# EAGLE design OSO-TIBO-A1-01 (EAGLE 9.4.2)

## Sheet 1 of 2
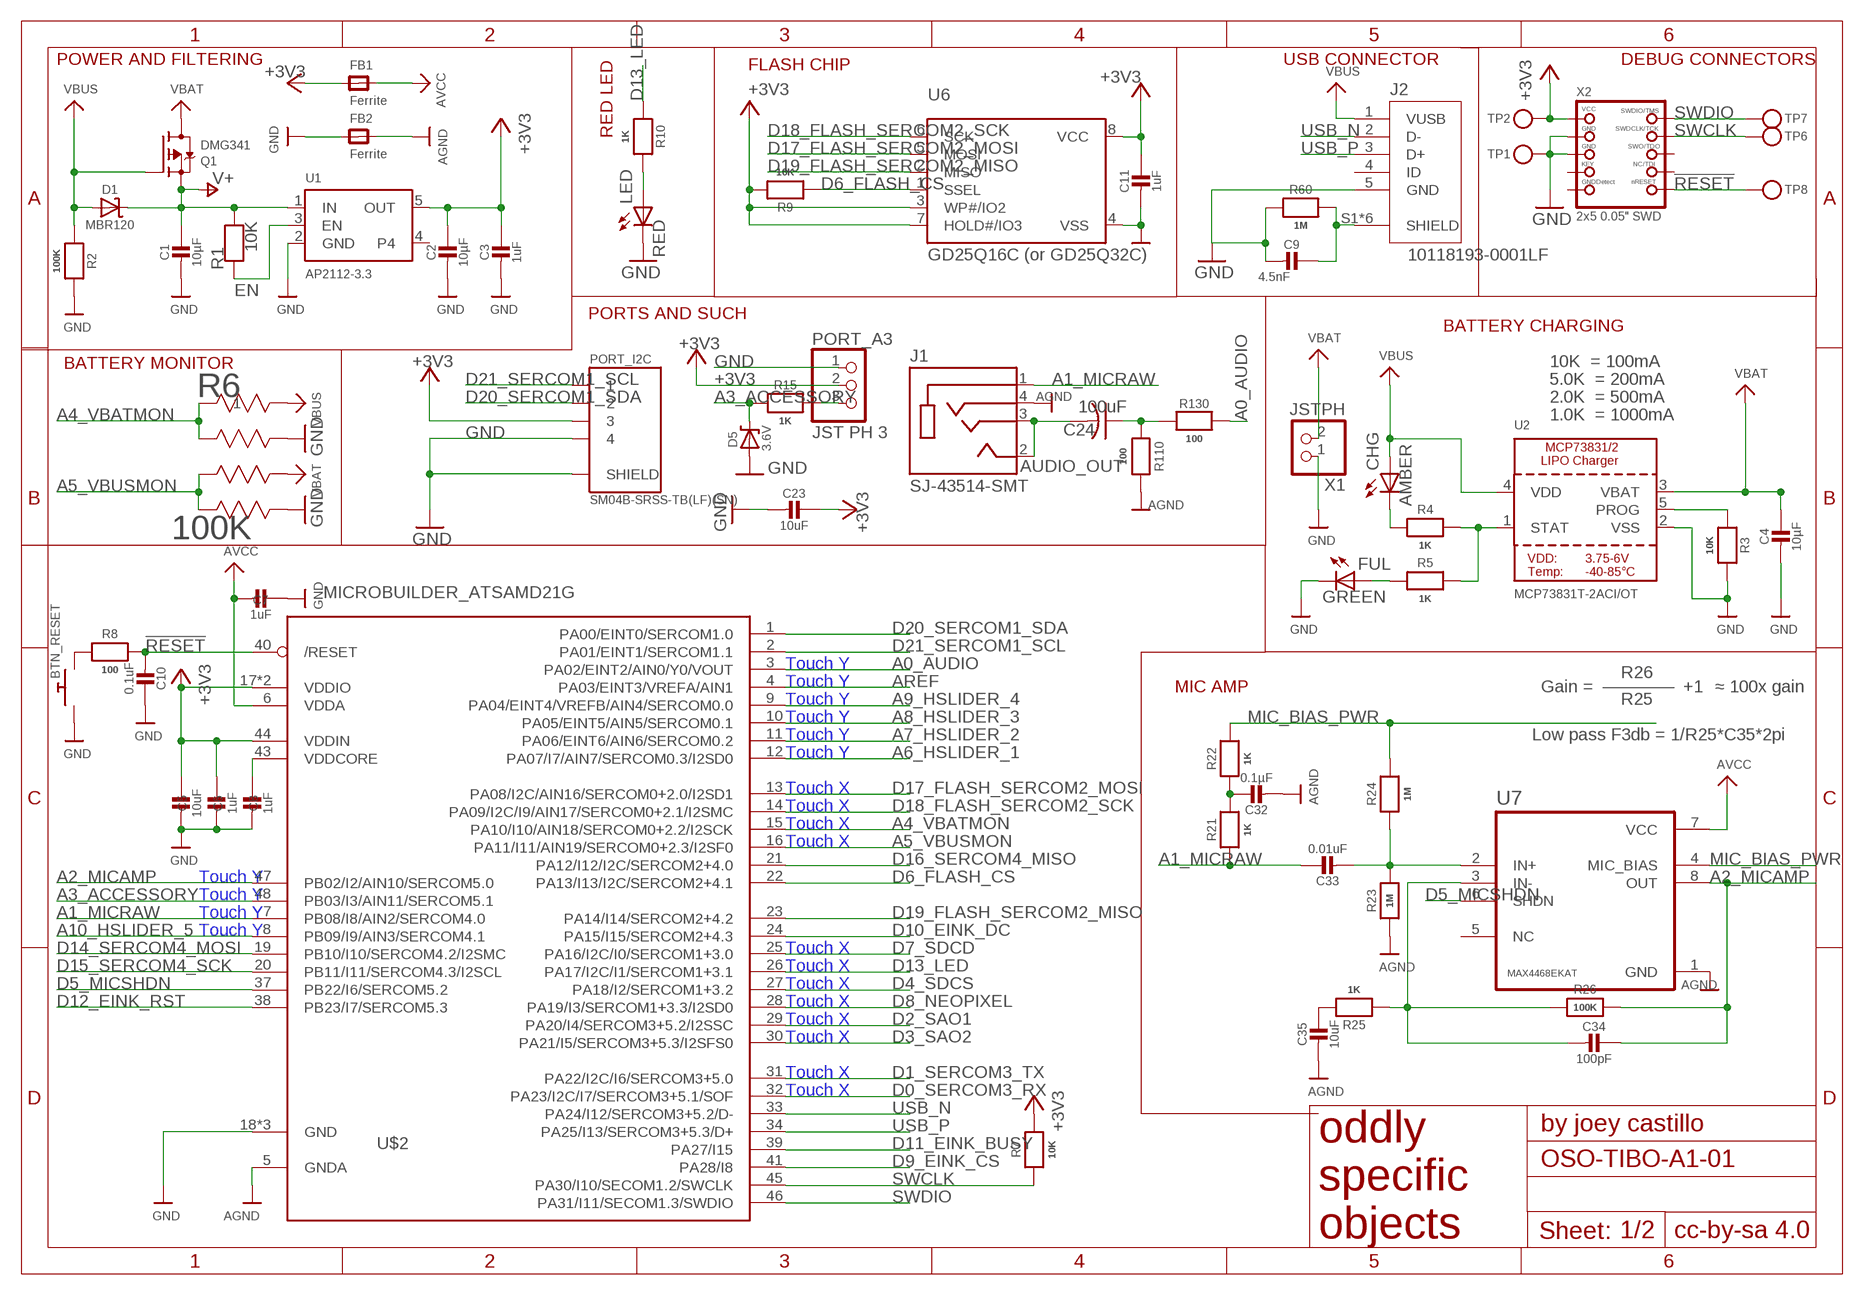
[diagram p0: schematic, sheet 1]

### Parts
BTN_RESET  SPST_TACTILE_SWITCHRA-THRU  [MJTP1117]
C1  10µF  CAP_CERAMIC0805-NOOUTLINE  [0805-NO]
C2  10µF  CAP_CERAMIC0805-NOOUTLINE  [0805-NO]
C3  1uF  CAP_CERAMIC0805-NOOUTLINE  [0805-NO]
C4  10µF  CAP_CERAMIC0805-NOOUTLINE  [0805-NO]
C5  10uF  CAP_CERAMIC0805_10MGAP  [0805_10MGAP]
C6  1uF  CAP_CERAMIC0805-NOOUTLINE  [0805-NO]
C7  1uF  CAP_CERAMIC0805-NOOUTLINE  [0805-NO]
C8  1uF  CAP_CERAMIC0805-NOOUTLINE  [0805-NO]
C9  4.5nF  CAP_CERAMIC0805-NOOUTLINE  [0805-NO]
C10  0.1uF  CAP_CERAMIC0805_10MGAP  [0805_10MGAP]
C11  1uF  CAP_CERAMIC0805_10MGAP  [0805_10MGAP]
C23  10uF  CAP_CERAMIC0805-NOOUTLINE  [0805-NO]
C24  100uF  C-USC1210  [C1210]
C32  0.1µF  CAP_CERAMIC0805-NOOUTLINE  [0805-NO]
C33  0.01uF  CAP_CERAMIC0805-NOOUTLINE  [0805-NO]
C34  100pF  CAP_CERAMIC0805-NOOUTLINE  [0805-NO]
C35  10uF  CAP_CERAMIC0805-NOOUTLINE  [0805-NO]
CHG  AMBER  LEDCHIP-LED0805  [CHIP-LED0805]
D1  MBR120  DIODE-SCHOTTKYSOD-123  [SOD-123]
D5  3.6V  DIODE-ZENERSOD123  [SOD-123]
FB1  Ferrite  FERRITE0805  [0805]
FB2  Ferrite  FERRITE0805  [0805]
FUL  GREEN  LEDCHIP-LED0805  [CHIP-LED0805]
J1  SJ-43514-SMT  [CUI_SJ-43514-SMT]
J2  10118193-0001LF  [FCI_10118193-0001LF]
LED  RED  LEDCHIP-LED0805  [CHIP-LED0805]
PORT_A3  JST PH 3  CON_JST_PH_3PIN  [JSTPH3]
PORT_I2C  SM04B-SRSS-TB(LF)(SN)  [JST_SM04B-SRSS-TB(LF)(SN)]
Q1  DMG341  MOSFET-P  [SOT23-R]
R1  10K  RESISTOR0805_NOOUTLINE  [0805-NO]
R2  100K  RESISTOR0805_NOOUTLINE  [0805-NO]
R3  10K  RESISTOR0805_NOOUTLINE  [0805-NO]
R4  1K  RESISTOR0805_NOOUTLINE  [0805-NO]
R5  1K  RESISTOR0805_NOOUTLINE  [0805-NO]
R6  100K  EXB-V8V103JV  [EXBV8V]
R7  10K  RESISTOR0805_NOOUTLINE  [0805-NO]
R8  100  RESISTOR0805_10MGAP  [0805_10MGAP]
R9  10K  RESISTOR0805_NOOUTLINE  [0805-NO]
R10  1K  RESISTOR0805_NOOUTLINE  [0805-NO]
R15  1K  RESISTOR_0805MP  [_0805MP]
R21  1K  RESISTOR0805_NOOUTLINE  [0805-NO]
R22  1K  RESISTOR0805_NOOUTLINE  [0805-NO]
R23  1M  RESISTOR0805_NOOUTLINE  [0805-NO]
R24  1M  RESISTOR0805_NOOUTLINE  [0805-NO]
R25  1K  RESISTOR0805_NOOUTLINE  [0805-NO]
R26  100K  RESISTOR0805_NOOUTLINE  [0805-NO]
R60  1M  RESISTOR0805_NOOUTLINE  [0805-NO]
R110  100  RESISTOR0805_NOOUTLINE  [0805-NO]
R130  100  RESISTOR0805_NOOUTLINE  [0805-NO]
TP1  TESTPOINTROUND2MMNO  [TESTPOINT_ROUND_2MM_NO]
TP2  TESTPOINTROUND2MMNO  [TESTPOINT_ROUND_2MM_NO]
TP6  TESTPOINTROUND2MMNO  [TESTPOINT_ROUND_2MM_NO]
TP7  TESTPOINTROUND2MMNO  [TESTPOINT_ROUND_2MM_NO]
TP8  TESTPOINTROUND2MMNO  [TESTPOINT_ROUND_2MM_NO]
U1  AP2112-3.3  VREG_SOT23-5  [SOT23-5]
U2  MCP73831T-2ACI/OT  MCP73831/2  [SOT23-5]
U6  GD25Q16C (or GD25Q32C)  MICROBUILDER_SPIFLASH_SOIC8  [MICROBUILDER_SOIC8_150MIL]
U7  MAX4468EKAT  [SOT65P280X145-8N]
U$2  MICROBUILDER_ATSAMD21G  [QFP50P900X900X120-48N]
X1  JSTPH  CON_JST_PH_2PIN  [JSTPH2]
X2  2x5 0.05" SWD  JTAG-CORTEXBOXPOSTS  [2X05_1.27MM_BOX_POSTS]

### Nets
!RESET: C10.2 R8.2 TP8.P$1 U$2.40(/RESET) X2.10(NRESET)
+3V3 [power]: C2.1 C3.1 C5.1 C6.1 C11.1 C23.1 FB1.1 PORT_A3.2 PORT_I2C.3 R7.2 R9.2 TP2.P$1 U1.5(OUT) U6.3(WP#/IO2) U6.7(HOLD#/IO3) U6.8(VCC) U$2.17(VDDIO) U$2.36(VDDIO) U$2.44(VDDIN) X2.1(VCC) ; also sheet 2
_ACCESSORY: PORT_A3.3 R15.1
A0_AUDIO: R130.1 U$2.3(PA02/EINT2/AIN0/Y0/VOUT)
A1_MICRAW: C33.1 J1.1(SLEEVE) R21.1 U$2.7(PB08/I8/AIN2/SERCOM4.0)
A2_MICAMP: C34.1 R26.2 U7.8(OUT) U$2.47(PB02/I2/AIN10/SERCOM5.0)
A3_ACCESSORY: D5.C R15.2 U$2.48(PB03/I3/AIN11/SERCOM5.1)
A4_VBATMON: R6.1 R6.2 U$2.15(PA10/I10/AIN18/SERCOM0+2.2/I2SCK)
A5_VBUSMON: R6.3 R6.4 U$2.16(PA11/I11/AIN19/SERCOM0+2.3/I2SF0)
A6_HSLIDER_1: U$2.12(PA07/I7/AIN7/SERCOM0.3/I2SD0) ; also sheet 2
A7_HSLIDER_2: U$2.11(PA06/EINT6/AIN6/SERCOM0.2) ; also sheet 2
A8_HSLIDER_3: U$2.10(PA05/EINT5/AIN5/SERCOM0.1) ; also sheet 2
A9_HSLIDER_4: U$2.9(PA04/EINT4/VREFB/AIN4/SERCOM0.0) ; also sheet 2
A10_HSLIDER_5: U$2.8(PB09/I9/AIN3/SERCOM4.1) ; also sheet 2
AGND [gnd]: C32.2 C35.2 FB2.2 J1.4(RING2) R23.1 R110.1 U7.1(GND) U$2.5(GNDA)
AREF: U$2.4(PA03/EINT3/VREFA/AIN1)
AUDIO_OUT: C24.2 J1.2(TIP) J1.3(RING1)
AVCC: C7.2 FB1.2 U7.7(VCC) U$2.6(VDDA)
D0_SERCOM3_RX: U$2.32(PA23/I2C/I7/SERCOM3+5.1/SOF) ; also sheet 2
D1_SERCOM3_TX: U$2.31(PA22/I2C/I6/SERCOM3+5.0) ; also sheet 2
D2_SAO1: U$2.29(PA20/I4/SERCOM3+5.2/I2SSC)
D3_SAO2: U$2.30(PA21/I5/SERCOM3+5.3/I2SFS0)
D4_SDCS: U$2.27(PA18/I2/SERCOM1+3.2) ; also sheet 2
D5_MICSHDN: U7.6(SHDN) U$2.37(PB22/I6/SERCOM5.2)
D6_FLASH_CS: R9.1 U6.1(SSEL) U$2.22(PA13/I13/I2C/SERCOM2+4.1)
D7_SDCD: U$2.25(PA16/I2C/I0/SERCOM1+3.0) ; also sheet 2
D8_NEOPIXEL: U$2.28(PA19/I3/SERCOM1+3.3/I2SD0) ; also sheet 2
D9_EINK_CS: U$2.41(PA28/I8) ; also sheet 2
D10_EINK_DC: U$2.24(PA15/I15/SERCOM2+4.3) ; also sheet 2
D11_EINK_BUSY: U$2.39(PA27/I15) ; also sheet 2
D12_EINK_RST: U$2.38(PB23/I7/SERCOM5.3) ; also sheet 2
D13_LED: R10.1 U$2.26(PA17/I2C/I1/SERCOM1+3.1)
D14_SERCOM4_MOSI: U$2.19(PB10/I10/SERCOM4.2/I2SMC) ; also sheet 2
D15_SERCOM4_SCK: U$2.20(PB11/I11/SERCOM4.3/I2SCL) ; also sheet 2
D16_SERCOM4_MISO: U$2.21(PA12/I12/I2C/SERCOM2+4.0) ; also sheet 2
D17_FLASH_SERCOM2_MOSI: U6.5(MOSI) U$2.13(PA08/I2C/AIN16/SERCOM0+2.0/I2SD1)
D18_FLASH_SERCOM2_SCK: U6.6(SCK) U$2.14(PA09/I2C/I9/AIN17/SERCOM0+2.1/I2SMC)
D19_FLASH_SERCOM2_MISO: U6.2(MISO) U$2.23(PA14/I14/SERCOM2+4.2)
D20_SERCOM1_SDA: PORT_I2C.2 U$2.1(PA00/EINT0/SERCOM1.0)
D21_SERCOM1_SCL: PORT_I2C.1 U$2.2(PA01/EINT1/SERCOM1.1)
EN: R1.1 U1.3(EN) ; also sheet 2
GND [gnd]: BTN_RESET.P$1 C1.2 C2.2 C3.2 C4.2 C5.2 C6.2 C7.1 C8.2 C9.2 C10.1 C11.2 C23.2 D5.A FB2.1 FUL.C J2.5(GND) LED.C PORT_A3.1 PORT_I2C.4 PORT_I2C.S1(SHIELD) PORT_I2C.S2(SHIELD) R2.2 R3.2 R6.5 R6.7 R60.2 TP1.P$1 U1.2(GND) U2.2(VSS) U6.4(VSS) U$2.18(GND) U$2.35(GND) U$2.42(GND) X1.1 X2.3(GND) X2.5(GND) ; also sheet 2
MIC_BIAS_PWR: R22.2 R24.2 U7.4(MIC_BIAS)
N$1: BTN_RESET.P$2 R8.1
N$4: CHG.C R4.1
N$6: C24.1 R110.2 R130.2
N$7: LED.A R10.2
N$9: FUL.A R5.1
N$65: C32.1 R21.2 R22.1
N$67: C33.2 R23.2 R24.1 U7.2(IN+)
N$68: C34.2 R25.1 R26.1 U7.3(IN-)
N$69: C35.1 R25.2
PROG: R3.1 U2.5(PROG)
SHIELD [gnd]: C9.1 J2.S1(SHIELD) J2.S2(SHIELD) J2.S3(SHIELD) J2.S4(SHIELD) J2.S5(SHIELD) J2.S6(SHIELD) R60.1
STAT: R4.2 R5.2 U2.1(STAT)
SWCLK: R7.1 TP6.P$1 U$2.45(PA30/I10/SECOM1.2/SWCLK) X2.4(SWDCLK)
SWDIO: TP7.P$1 U$2.46(PA31/I11/SECOM1.3/SWDIO) X2.2(SWDIO)
USB_N: J2.2(D-) U$2.33(PA24/I12/SERCOM3+5.2/D-)
USB_P: J2.3(D+) U$2.34(PA25/I13/SERCOM3+5.3/D+)
V+ [power]: C1.1 D1.C Q1.2(S) R1.2 U1.1(IN)
VBAT [power]: C4.1 Q1.3(D) R6.6 U2.3(VBAT) X1.2
VBUS [power]: CHG.A D1.A J2.1(VUSB) Q1.1(G) R2.1 R6.8 U2.4(VDD)
VDDCORE: C8.1 U$2.43(VDDCORE)
Unconnected: J2.4(ID) U1.4 U7.5(NC) X2.6(SWO) X2.7(KEY) X2.8(TDI) X2.9(GNDDETECT)

### Notes on the sheet
- RED LED
- POWER AND FILTERING | USB CONNECTOR | DEBUG CONNECTORS
- FLASH CHIP
- PORTS AND SUCH
- BATTERY CHARGING
- BATTERY MONITOR | 10K  = 100mA
- 5.0K  = 200mA
- 2.0K  = 500mA
- 1.0K  = 1000mA
- Touch Y
- R26
- Touch Y
- MIC AMP | Gain = | +1 | ≈ 100x gain
- Touch Y | R25
- Touch Y
- Touch Y | Low pass F3db = 1/R25*C35*2pi
- Touch Y
- Touch X
- Touch X
- Touch X
- Touch X
- Touch Y
- Touch Y
- Touch Y
- Touch Y
- Touch X
- Touch X
- Touch X
- Touch X
- Touch X
- Touch X
- Touch X
- Touch X

## Sheet 2 of 2
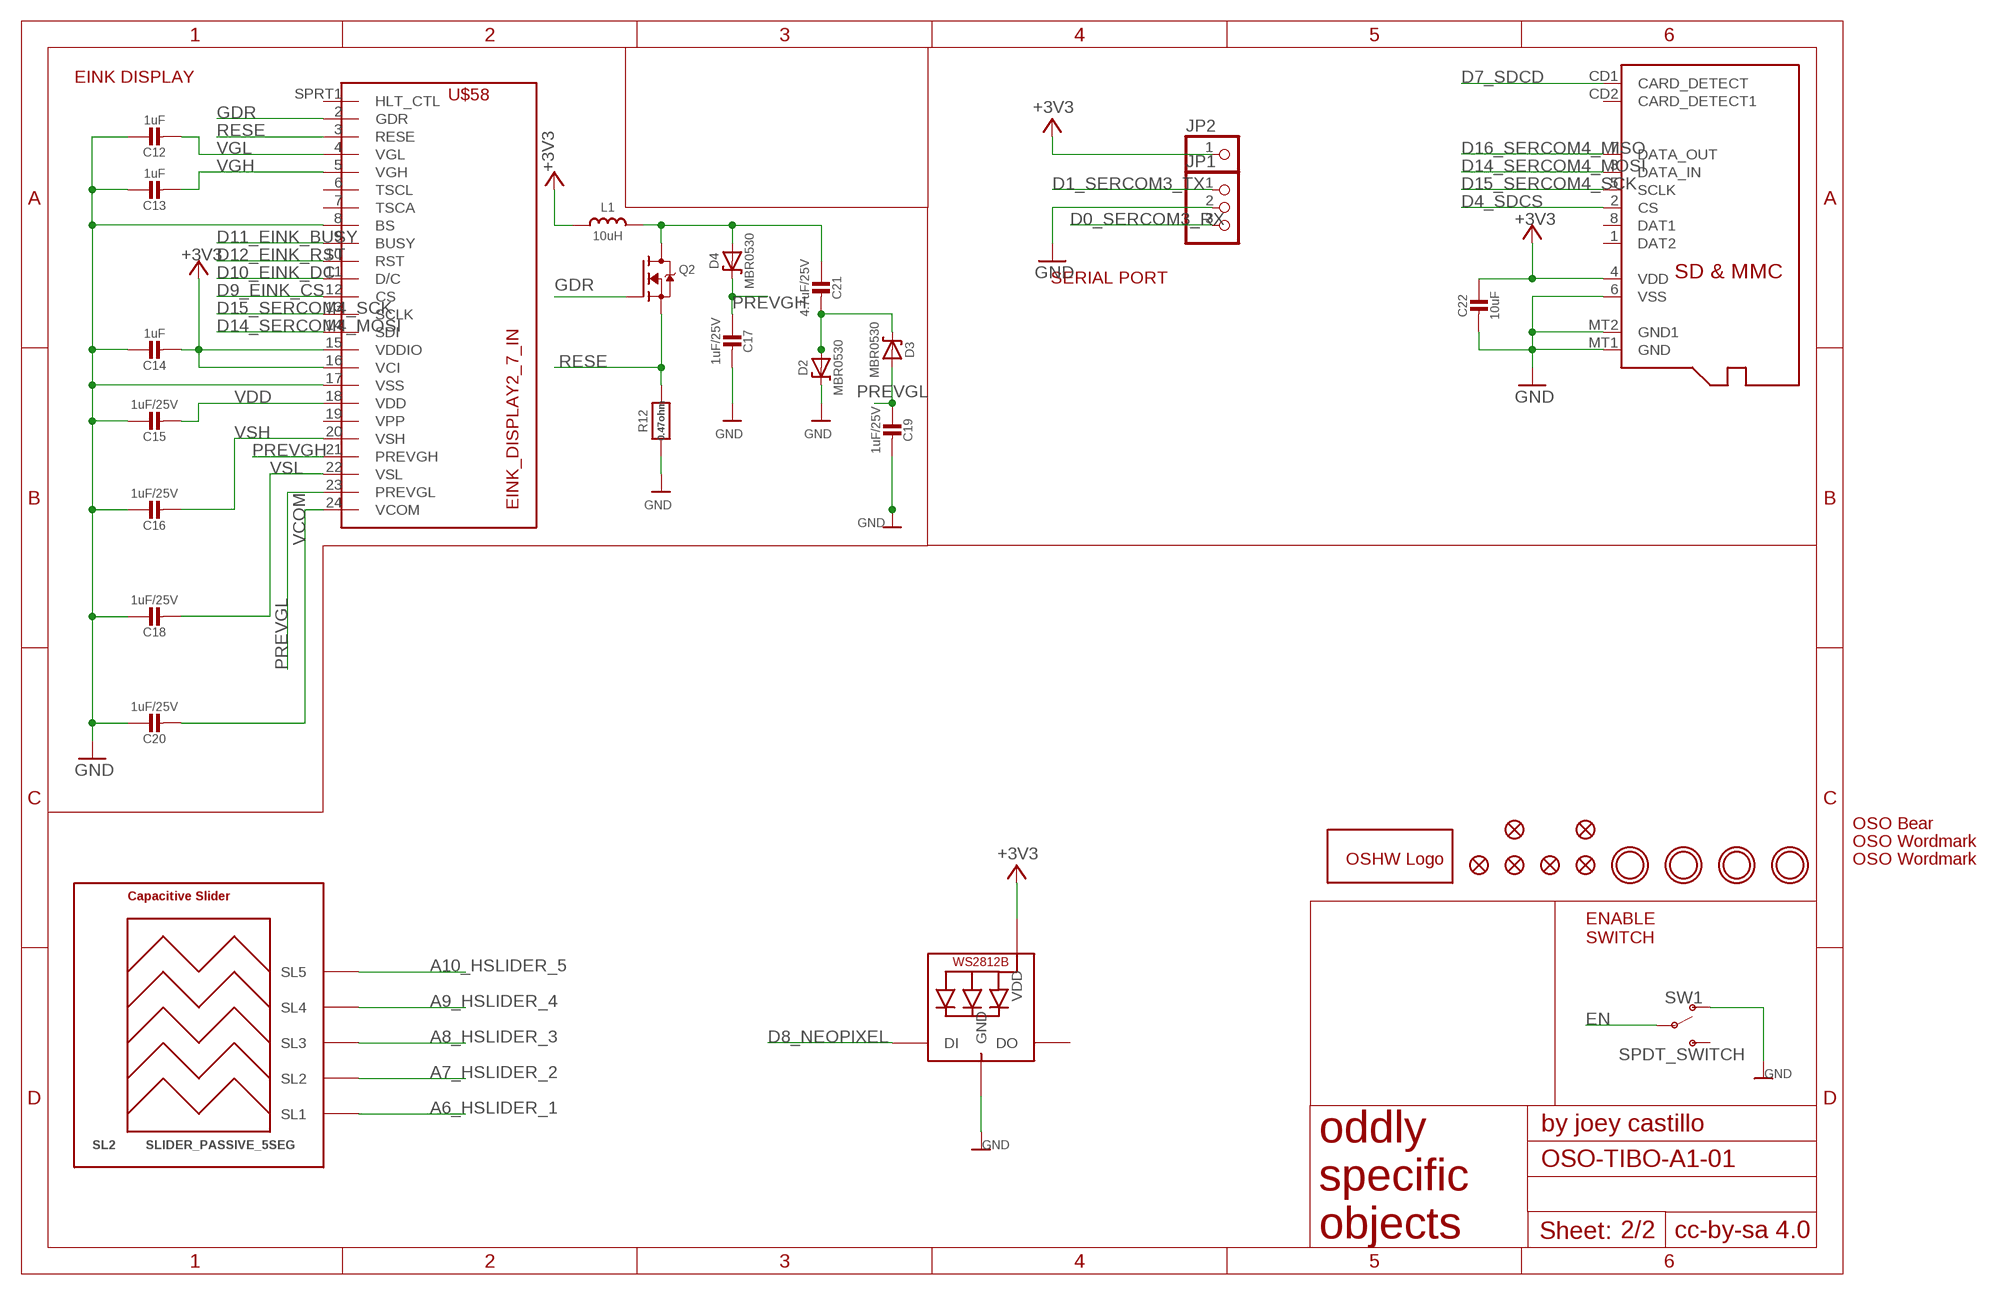
[diagram p1: schematic, sheet 2]

### Parts
C12  1uF  CAP_CERAMIC0805_10MGAP  [0805_10MGAP]
C13  1uF  CAP_CERAMIC0805_10MGAP  [0805_10MGAP]
C14  1uF  CAP_CERAMIC0805_10MGAP  [0805_10MGAP]
C15  1uF/25V  CAP_CERAMIC0805_10MGAP  [0805_10MGAP]
C16  1uF/25V  CAP_CERAMIC0805_10MGAP  [0805_10MGAP]
C17  1uF/25V  CAP_CERAMIC0805_10MGAP  [0805_10MGAP]
C18  1uF/25V  CAP_CERAMIC0805_10MGAP  [0805_10MGAP]
C19  1uF/25V  CAP_CERAMIC0805_10MGAP  [0805_10MGAP]
C20  1uF/25V  CAP_CERAMIC0805_10MGAP  [0805_10MGAP]
C21  4.7uF/25V  CAP_CERAMIC0805-NOOUTLINE  [0805-NO]
C22  10uF  CAP_CERAMIC0805_10MGAP  [0805_10MGAP]
D2  MBR0530  DIODE-SCHOTTKYSOD-123  [SOD-123]
D3  MBR0530  DIODE-SCHOTTKYSOD-123  [SOD-123]
D4  MBR0530  DIODE-SCHOTTKYSOD-123  [SOD-123]
D8_NEOPIXEL  WS2812B_4020  [WS2812B_4020]
FID1  FIDUCIAL_1MM  [FIDUCIAL_1MM]
FID2  FIDUCIAL_1MM  [FIDUCIAL_1MM]
FID3  FIDUCIAL_1MM  [FIDUCIAL_1MM]
FID4  FIDUCIAL_1MM  [FIDUCIAL_1MM]
FID5  FIDUCIAL_1MM  [FIDUCIAL_1MM]
FID6  FIDUCIAL_1MM  [FIDUCIAL_1MM]
GOLD_ORB_SM1  OSHWLOGOLOGO5MM  [OSHW_5MM]
JP1  PINHD-1X3  [1X03]
JP2  PINHD-1X1  [1X01]
L1  10uH  INDUCTORNR401  [INDUCTOR_4X4MM_NR401]
MICROSD  MICROSD  [MICROSD]
Q2  IRLML0100  IRLML2060TRPBF  [SOT23-3]
R12  0.47ohm  RESISTOR0805_10MGAP  [0805_10MGAP]
SL2  SLIDER_PASSIVE_5SEG  [SLIDER_PASSIVE_5SEG_12MM]
SW1  SPDT_SWITCH  [A10767]
U$1  MOUNTINGHOLE2.5  [MOUNTINGHOLE_2.5_PLATED]
U$4  MOUNTINGHOLE2.5  [MOUNTINGHOLE_2.5_PLATED]
U$5  MOUNTINGHOLE2.5  [MOUNTINGHOLE_2.5_PLATED]
U$7  MOUNTINGHOLE2.5  [MOUNTINGHOLE_2.5_PLATED]
U$45  OSO_BEAR  [OSO_BEAR_750MIL]
U$47  OSO_TEXT  [OSO_TEXT_435MIL]
U$48  OSO_TEXTOSO_TEXT_ONELINE_125MIL  [OSO_ONELINE_125MIL]
U$58  EINK_DISPLAY2_7_IN  [EINK_DISPLAY_2_7_IN]

### Nets
+3V3 [power]: C14.2 C22.1 D8_NEOPIXEL.2(VDD) JP2.1 L1.P$2 MICROSD.4(VDD) U$58.15(VDDIO) U$58.16(VCI) ; also sheet 1
A6_HSLIDER_1: SL2.SL1 ; also sheet 1
A7_HSLIDER_2: SL2.SL2 ; also sheet 1
A8_HSLIDER_3: SL2.SL3 ; also sheet 1
A9_HSLIDER_4: SL2.SL4 ; also sheet 1
A10_HSLIDER_5: SL2.SL5 ; also sheet 1
D0_SERCOM3_RX: JP1.3 ; also sheet 1
D1_SERCOM3_TX: JP1.1 ; also sheet 1
D4_SDCS: MICROSD.2(CS) ; also sheet 1
D7_SDCD: MICROSD.CD1(CARD_DETECT) ; also sheet 1
D8_NEOPIXEL: D8_NEOPIXEL.1(DI) ; also sheet 1
D9_EINK_CS: U$58.12(CS) ; also sheet 1
D10_EINK_DC: U$58.11(D/C) ; also sheet 1
D11_EINK_BUSY: U$58.9(BUSY) ; also sheet 1
D12_EINK_RST: U$58.10(RST) ; also sheet 1
D14_SERCOM4_MOSI: MICROSD.3(DATA_IN) U$58.14(SDI) ; also sheet 1
D15_SERCOM4_SCK: MICROSD.5(SCLK) U$58.13(SCLK) ; also sheet 1
D16_SERCOM4_MISO: MICROSD.7(DATA_OUT) ; also sheet 1
EN: SW1.P$2(P) ; also sheet 1
GDR: Q2.1(G) U$58.2(GDR)
GND [gnd]: C12.1 C13.1 C14.1 C15.1 C16.1 C17.2 C18.1 C19.2 C20.1 C22.2 D2.C D8_NEOPIXEL.4(GND) JP1.2 MICROSD.6(VSS) MICROSD.MT1(GND) MICROSD.MT2(GND1) R12.2 SW1.P$1(O) U$58.8(BS) U$58.17(VSS) ; also sheet 1
N$2: C21.2 D2.A D3.C
N$3: C21.1 D4.A L1.P$1 Q2.3(D)
PREVGH: C17.1 D4.C U$58.21(PREVGH)
PREVGL: C19.1 D3.A U$58.23(PREVGL)
RESE: Q2.2(S) R12.1 U$58.3(RESE)
VCOM: C20.2 U$58.24(VCOM)
VDD: C15.2 U$58.18(VDD)
VGH: C13.2 U$58.5(VGH)
VGL: C12.2 U$58.4(VGL)
VSH: C16.2 U$58.20(VSH)
VSL: C18.2 U$58.22(VSL)
Unconnected: D8_NEOPIXEL.3(DO) MICROSD.1(DAT2) MICROSD.8(DAT1) MICROSD.CD2(CARD_DETECT1) SW1.P$3(S) U$58.6(TSCL) U$58.7(TSCA) U$58.19(VPP) U$58.SPRT1(HLT_CTL)

### Notes on the sheet
- EINK DISPLAY
- SERIAL PORT
- ENABLE
  SWITCH

## Library data of the parts
BTN_RESET = My Stuff:SPST_TACTILE_SWITCH
C1-C23 C32-C35 = microbuilder:CAP_CERAMIC: Ceramic Capacitors For new designs, use the packages preceded by an '_' character since they are more reliable: The following footprints should be used on most boards: _0402 - Standard footprint for regular board layouts _0603 - Standard footprint for regular board layouts _0805 - Standard footprint for regular board layouts _1206 - Standard footprint for regular board layouts For extremely tight-pitch boards where space is at a premium, the following 'micro-pitch' footprints can be used (smaller pads, no silkscreen outline, etc.): _0402MP - Micro-pitch footprint for very dense/compact boards _0603MP - Micro-pitch footprint for very dense/compact boards _0805MP - Micro-pitch footprint for very dense/compact boards _1206MP - Micro-pitch footprint for very dense/compact boards
C24 = resistor:C-US: CAPACITOR, American symbol
CHG FUL LED = adafruit:LED: LED OSRAM: - CHIPLED LG R971, LG N971, LY N971, LG Q971, LY Q971, LO R971, LY R971 LH N974, LH R974 LS Q976, LO Q976, LY Q976 LO Q996 - Hyper CHIPLED LW Q18S LB Q993, LB Q99A, LB R99A - SideLED LS A670, LO A670, LY A670, LG A670, LP A670 LB A673, LV A673, LT A673, LW A673 LH A674 LY A675 LS A676, LA A676, LO A676, LY A676, LW A676 LS A679, LY A679, LG A679 - Hyper Micro SIDELED® LS Y876, LA Y876, LO Y876, LY Y876 LT Y87S - SmartLED LW L88C, LW L88S LB L89C, LB L89S, LG L890 LS L89K, LO L89K, LY L89K LS L896, LA L896, LO L896, LY L896 - TOPLED LS T670, LO T670, LY T670, LG T670, LP T670 LSG T670, LSP T670, LSY T670, LOP T670, LYG T670 LG T671, LOG T671, LSG T671 LB T673, LV T673, LT T673, LW T673 LH T674 LS T676, LA T676, LO T676, LY T676, LB T676, LH T676, LSB T676, LW T676 LB T67C, LV T67C, LT T67C, LS T67K, LO T67K, LY T67K, LW E67C LS E67B, LA E67B, LO E67B, LY E67B, LB E67C, LV E67C, LT E67C LW T67C LS T679, LY T679, LG T679 LS T770, LO T770, LY T770, LG T770, LP T770 LB T773, LV T773, LT T773, LW T773 LH T774 LS E675, LA E675, LY E675, LS T675 LS T776, LA T776, LO T776, LY T776, LB T776 LHGB T686 LT T68C, LB T68C - Hyper Mini TOPLED® LB M676 - Mini TOPLED Santana® LG M470 LS M47K, LO M47K, LY M47K Source: http://www.osram.convergy.de/
D1-D4 = microbuilder:DIODE-SCHOTTKY
D5 = microbuilder:DIODE-ZENER: Zener Diode SMA: 30V 1W Zener Diode, 1.2Vf - Digikey: SMAZ30-FDICT-ND
D8_NEOPIXEL = microbuilder:WS2812B
FB1 FB2 = microbuilder:FERRITE: Ferrite Bead 0603 MMZ1608B121C - 120 Ohm @ 100MHz, 600mA, 0.15 Ohm DC Resistance - Digikey: 445-2164-1-ND BK1608HW121-T - 120 Ohm, 600mA Ferrite Chip - Digikey: 587-1876-2-ND 0805 HZ0805B272R-10 - 2.7K Ohm @ 100MHz, 200mA, 0.8 Ohm DC Resistance - Digikey: 240-2504-1-ND (see also Murata BLM21BD272SN1L) MMZ2012Y152B - 1.5K Ohm @ 100MHz, 500mA, 0.4 Ohm DC Resistance - Digikey: 445-1560-1-ND - Mainly for high frequency (80-400MHz) MMZ2012R102A - 1K Ohm @ 100MHz, 500mA, 0.3 Ohm DC Resistance - Digikey: 445-1555-2-ND - More general purpose (10-200MHz)
FID1-FID6 = microbuilder:FIDUCIAL: Fiducial Alignment Points Various fiducial points for machine vision alignment.; BOM: EXCLUDE
GOLD_ORB_SM1 = oshw:OSHWLOGO: The OSHW logo for PCB layout
J1 = SJ-43514-SMT:SJ-43514-SMT: 4 conductor 3.5 mm Surface Mount Audio Jack; CUI_PURCHASE_URL: https://www.cui.com/product/interconnect/connectors/audio-connectors/jacks/sj-4351x-smt-series?utm_source=snapeda.com&utm_medium=referral&utm_campaign=snapedaBOM; DESCRIPTION: 3.5 mm, 4 Conductors, Right Angle, Surface Mount _SMT_, Audio Jack Connector; DIGI-KEY_PART_NUMBER: CP-43514SJCT-ND; DIGI-KEY_PURCHASE_URL: https://www.digikey.com/product-detail/en/cui-inc/SJ-43514-SMT-TR/CP-43514SJCT-ND/669734?utm_source=snapeda&utm_medium=aggregator&utm_campaign=symbol; MF: CUI Inc.; MP: SJ-43514-SMT-TR; PACKAGE: None
J2 = 10118193-0001LF:10118193-0001LF: Micro USB B Type Receptacle; DESCRIPTION: Single Port 5 Contact Shielded SMT MICRO USB B-Type Receptacle; DIGI-KEY_PART_NUMBER: 609-4616-1-ND; DIGI-KEY_PURCHASE_URL: https://www.digikey.com/product-detail/en/amphenol-icc-fci/10118193-0001LF/609-4616-1-ND/2785380?utm_source=snapeda&utm_medium=aggregator&utm_campaign=symbol; MF: Amphenol ICC; MP: 10118193-0001LF; PACKAGE: None
JP1 = adafruit:PINHD-1X3: PIN HEADER
JP2 = adafruit:PINHD-1X1: Pin header 1x1 for 0.1" spacing With round pins
L1 = microbuilder:INDUCTOR: Inductors 0603: 10nH Ceramic Inductor - microwire antenna/RF (Digikey: 712-1434-2-ND) 0805: 560nH Ceramic Inductor - RF (Digikey: 553-1047-1-ND) 270nH Ceramic Inductor - Q = 40@250MHz, +-5%, 1 Ohm DC Resistance (Digikey: 535-10506-2-ND) 1007 (2518 Metric) SMT: 10µH 10% 250mOhm 820mA 1007 Inductor (Digikey: 587-2189-1-ND) 22µH 10% 500mOhm 580mA 1007 Inductor (Digikey: 587-2190-1-ND) 47µH 10% 950mOhm 420mA 1007 Inductor (Digikey: 587-2191-1-ND) 47µH 5% 100mOhm 1A 1008 Inductor (Digikey: 732-1816-1-ND) 5.0x5.0mm (Taiyo Yuden NR5040 Series) 6.8µH 20% 2.3A 64mOhm Inductor (Digikey: 587-2374-2-ND) 5.0x5.0mm (TDK VLC5045 Series) 4.7µH 20% 3.3A 34mOhm Inductor (Digikey: 445-6526-1-ND) 6.8µH 20% 2.7A 46mOhm Inductor (Digikey: 445-6527-1-ND) 6.0x6.0mm (TDK VLC6045 Series) 4.7µH 20% 3.8A 27mOhm Inductor (Digikey: 445-6538-2-ND) 6.8µH 20% 3A 41mOhm Inductor (Digikey: 445-6540-1-ND) 6.2µH 30% 2.2A 45mOhm Inductor (Digikey: SRR5028-6R2YCT-ND) - Not TDK VLC6045 but footprint should match 6.0x6.0mm (TDK SLF6045 Series) 6.8uH 30% 2A 33mOhm Inductor (Digikey: 445-4572-1-ND, Mouser: 810-SLF645T6R8N2R0PF) 6.0x6.0mm (Sumida CDRH5D28 Series) 6.2uH 30% 1.8A 45mOhm Inductor (Digikey: 308-1542-1-ND) Taiyo Yuden NR3015T2R2M - 2.2uH 20% 1.5A (Digikey: 587-1648-2-ND, Mouser: 963-NR3015T2R2M) - Used with TI TPS62172 CoilCraft RFID Transponder Coil - MA5532-AE (For use with AS3935 Lightning Sensor) Taiyo Yuden NRH2412T2R2MNGH - 2.2uH 20% 1AA (Digikey: 587-3443-1-ND) - Used with TI LM3671 Vishay IHLP 1.0uH Molded Inductor - 24mOhm DCR, 5A, +/-20%, -55°C-125°C (Digikey: 541-1319-1-ND)
MICROSD = adafruit:MICROSD: Micro-SD / Transflash card holder with SPI pinout For the 3M # 2908-05WB-MG and/or 4UCON #19656 push-push type
PORT_A3 = microbuilder:CON_JST_PH_3PIN
PORT_I2C = SM04B-SRSS-TB_LF__SN_:SM04B-SRSS-TB(LF)(SN): SH Series 1.0 mm Pitch 2 Position Single Row Side Entry Shrouded Header; DESCRIPTION: SH Series 1.0 mm Pitch 2 Position Single Row Side Entry Shrouded Header; DIGI-KEY_PART_NUMBER: 455-1804-1-ND; DIGI-KEY_PURCHASE_URL: https://www.digikey.com/product-detail/en/jst-sales-america-inc/SM04B-SRSS-TB_LF__SN_/455-1804-1-ND/926875?utm_source=snapeda&utm_medium=aggregator&utm_campaign=symbol; MF: JST Sales; MP: SM04B-SRSS-TB_LF__SN_; PACKAGE: None
Q1 = microbuilder:MOSFET-P: P-Channel Mosfet LEGEND VDS: Voltage Drain-Source ID: Drain Current RDS(ON): Drain-Source On-State Resistance VGS(TH): Gate-Source Threshold Voltage CISS: Drain-Source Input Capacitance SOT-23 Name VDS ID RDS(ON) VGS(TH) CISS Order Number IRLML5103 30V 760mA 600 mOhm -- 75pF @ 25V Digikey: IRLML5103PBFCT-ND IRLML6401 12V 4.3A 50 mOhm 950mV @ 250µA 830pF @ 10V Digikey: IRLML6401PBFTR-ND NTR0202PL 20V 400mA 800 mOhm 2.3V @ 250uA 70pF @ 5V Digikey: NTR0202PLT1GOSTR-ND NTR4101PT1G 20V 1.8A 85 mOhm 1.2V @ 250uA 675pF @ 10V Digikey: NTR4101PT1GOSCT-ND DMP2004K 20V 600mA 900 mOhm 1V @ 250uA 175pF @ 16V Digikey: DMP2004KDICT-ND PMV65XP 20V 3.9A 76 mOhm 950mV @ 1mA 725pF @ 20V Digikey: 568-2358-2-ND TO-252 Name VDS ID RDS(ON) VGS(TH) CISS Order Number AOD417 30V 25A 34 mOhm 3V @ 250µA 920pF @ 15V Digikey: 785-1106-2-ND PowerPak Name VDS ID RDS(ON) VGS(TH) CISS Order Number AON7401 30V 12A 14 mOhm 3V @ 250µA 2600pF @ 15V Digikey: 785-1302-1-ND
Q2 = Parts:IRLML2060TRPBF
R1-R5 R7-R10 R12 R15 R21-R26 R60 R110 R130 = microbuilder:RESISTOR: Resistors For new designs, use the packages preceded by an '_' character since they are more reliable: The following footprints should be used on most boards: _0402 - Standard footprint for regular board layouts _0603 - Standard footprint for regular board layouts _0805 - Standard footprint for regular board layouts _1206 - Standard footprint for regular board layouts For extremely tight-pitch boards where space is at a premium, the following 'micro-pitch' footprints can be used (smaller pads, no silkscreen outline, etc.): _0402MP - Micro-pitch footprint for very dense/compact boards _0603MP - Micro-pitch footprint for very dense/compact boards _0805MP - Micro-pitch footprint for very dense/compact boards _1206MP - Micro-pitch footprint for very dense/compact boards
R6 = resistor array:EXB-V8V103JV; MANUFACTURER_PART_NUMBER: EXBV8V103JV; VENDOR: Panasonic
SL2 = PatternAgents-TouchWidgets:SLIDER_PASSIVE_5SEG: Slider, Passive Touch/Capacitive Sensing Type, Five (5) Segment Source : http://www.PatternAgents.com Github : https://github.com/PatternAgents License : http://creativecommons.org/licenses/by-sa/3.1/ (Creative Commons 3.1) THIS SOFTWARE IS PROVIDED BY THE CONTRIBUTORS "AS IS" AND WITHOUT ANY EXPRESS OR IMPLIED WARRANTIES, INCLUDING, BUT NOT LIMITED TO, THE IMPLIED WARRANTIES OF MERCHANTABILITY AND FITNESS FOR A PARTICULAR PURPOSE ARE DISCLAIMED. IN NO EVENT SHALL THE COPYRIGHT OWNER OR CONTRIBUTORS BE LIABLE FOR ANY DIRECT, INDIRECT, INCIDENTAL, SPECIAL, EXEMPLARY, OR CONSEQUENTIAL DAMAGES (INCLUDING, BUT NOT LIMITED TO, PROCUREMENT OF SUBSTITUTE GOODS OR SERVICES; LOSS OF USE, DATA, OR PROFITS; OR BUSINESS INTERRUPTION) HOWEVER CAUSED AND ON ANY THEORY OF LIABILITY, WHETHER IN CONTRACT, STRICT LIABILITY, OR TORT (INCLUDING NEGLIGENCE OR OTHERWISE) ARISING IN ANY WAY OUT OF THE USE OF THIS SOFTWARE, EVEN IF ADVISED OF THE POSSIBILITY OF SUCH DAMAGE.
SW1 = My Stuff:SPDT_SWITCH
TP1 TP2 TP6-TP8 = microbuilder:TESTPOINT: Test Point Various test points for characterisation and PCB testing TESTPOINT_SMT - Compact Surface Mount Test Point [Digikey: 5016KTR-ND]
U1 = microbuilder:VREG_SOT23-5: SOT23-5 Fixed Voltage Regulators Part Current Out V Out V In V Dropout θJA (°C/W) TJ (°C) Digikey Part No. ADP121 150mA 3.3V 3.4-5.5V 0.09V @ 150mA -- -- ADP121-AUJZ33R7CT-ND ADP121 150mA 3.0V 3.1-5.5V 0.09V @ 150mA -- -- ADP121-AUJZ30R7CT-ND ADP122 300mA 3.3V 3.4-5.5V 0.085V @ 300mA -- -- ADP122AUJZ-3.3-R7CT-ND ADP1712 300mA 3.3V 3.5-5.5V 0.17V @ 300mA -- -- ADP1712AUJZ-3.3-R7TR-ND AP7311 (Low Cost) 150mA 3.3V 3.5-6V 0.15V @ 150mA -- -- AP7311-33WG-7DICT-ND LD39015M18R 150mA 1.8V 1.9V-5.5V 0.08V @ 100mA -- -- 497-6977-1-ND LP2985A-33DBVR 150mA 3.3V 3.3-16V 0.28V @ 150mA 206 150 296-18479-1-ND MCP1824T-3302E/OT 300mA 3.3V 3.5V-6V 0.2V @ 300mA -- -- MCP1824T-3302E/OTCT-ND MIC5205-2.5YM5 TR 150mA 2.5V 2.7-16V 0.165V @ 150mA -- -- 576-1257-2-ND MIC5205-3.0YM5 TR 150mA 3.0V 3.2V-16V 0.165V @ 150mA -- -- 576-1258-2-ND MIC5205-3.3YM5 TR 150mA 3.3V 3.5V-16V 0.165V @ 150mA -- -- 576-1259-2-ND TPS780330220 150mA 3.3V+2.2V 3.6-5.5V 250mV Max -- -- 296-23332-1-ND TDA3663/N1,135 100mA 3.3V 3.5-45V 0.18V @ 50mA -- -- 568-5343-1-ND Max operating temp can be calculated using θJA, TJ (max junction temperature), and power in watts. Set the "Maximum Ambient Temperature" until it reaches TJ ("Max Junction Temperature"), which is the absolute limit for safe use of the regulator: Heat Sink Temperature Calculator <http://www.daycounter.com/Calculators/Heat-Sink-Temperature-Calculator.phtml> For example, With 12V source into a 3.3V LP2985 and a 30mA load, we are dissipating (12V-3.3V) * 0.03A = 0.261W. With a θJA of 206 °C/W, a TJ of 150°C, and 261mW we can safely use the chip without a heat sink up to 75°C (=147.1°C Junction Temperature).
U2 = microbuilder:MCP73831/2: MCP73831/2 LIPO Charger VDD: 3.75 - 6V Temp -40 - 85°C Programmable Charge Rate: 15-500mA NOTE: STAT is a tri-state logic output on the MCP73831 and an open-drain output on the MCP73832. SOT23-5 with 4.2V output and tri-state logic on STAT = MCP73831T-2ACI/OT
U6 = Adafruit Feather M0 Express:MICROBUILDER_SPIFLASH_SOIC8: SOIC8 SPI Flash Be careful with the size since SOIC8 flash comes in several 'widths' SOIC8 150 mil M25P16 - 16Mbit (2Mbit x 8) Serial Flash (75MHz SPI Bus), Supply: 2.7-3.6V Digikey: SOIC8 - M25P16-VMN6P-ND SOIC8 208 mil W25Q16BVSSIG - 16Mbit (2Mbit x 8) Serial Flash (104MHz SPI Bus), Supply: 2.7-3.6V Digikey: SOIC8 - W25Q16BVSSIG-ND
U7 = MAX4468EKAT:MAX4468EKAT; DESCRIPTION: Audio Amp Microphone 1-CH Mono Class-AB 8-Pin SOT-23 T/R; DIGI-KEY_PART_NUMBER: MAX4468EKA+CT-ND; DIGI-KEY_PURCHASE_URL: https://www.digikey.com/product-detail/en/maxim-integrated/MAX4468EKA-T/MAX4468EKA-CT-ND/5405777?utm_source=snapeda&utm_medium=aggregator&utm_campaign=symbol; MF: Maxim Integrated; MP: MAX4468EKA+T; PACKAGE: SOT-23-8 Maxim
U$1 U$4 U$5 U$7 = microbuilder:MOUNTINGHOLE: Mounting Hole For #2 screws (0.086"/2.18mm width, 0.094"/2.4mm hole) use 2.5mm; BOM: EXCLUDE
U$2 = Adafruit Feather M0 Express:MICROBUILDER_ATSAMD21G
U$45 = My Stuff:OSO_BEAR
U$47 U$48 = My Stuff:OSO_TEXT
U$58 = My Stuff:EINK_DISPLAY
X1 = microbuilder:CON_JST_PH_2PIN: JST 2-Pin Right-Angle Connector PH-Series - 4UConnector: 17311 SH-Series - 4UConnector: 07278
X2 = microbuilder:JTAG-CORTEX: Serial Wire (SW-DP) Connector Standard 0.05" 10-pin connector is for use with the Cortex M and Cortex A SWD (serial wire debugger) interface (SW-DP) Connectors 2x05_1.27MM_SMT - Inexpensive surface-mount header with bare pins, compatible with standard 10-pin SWD cables (4UCON: 16846) 2x05_1.27MM_BOX_NOPOSTS - Polarised surface-mount box (4UCON with caps: 19735, without caps: 15117 2x05_1.27MM_BOX_POSTS - Polarised surface-mount box with mounting holes (4UCON: 20317) Pinout: http://infocenter.arm.com/help/topic/com.arm.doc.faqs/attached/13634/cortex_debug_connectors.pdf http://www.keil.com/peripherals/coresight/connectors.asp

## Net classes
0 default: width 0.152 mm, drill 0.254 mm
1 power: width 0.305 mm, drill 0.305 mm
2 gnd: width 0.254 mm, drill 0.254 mm

## Board
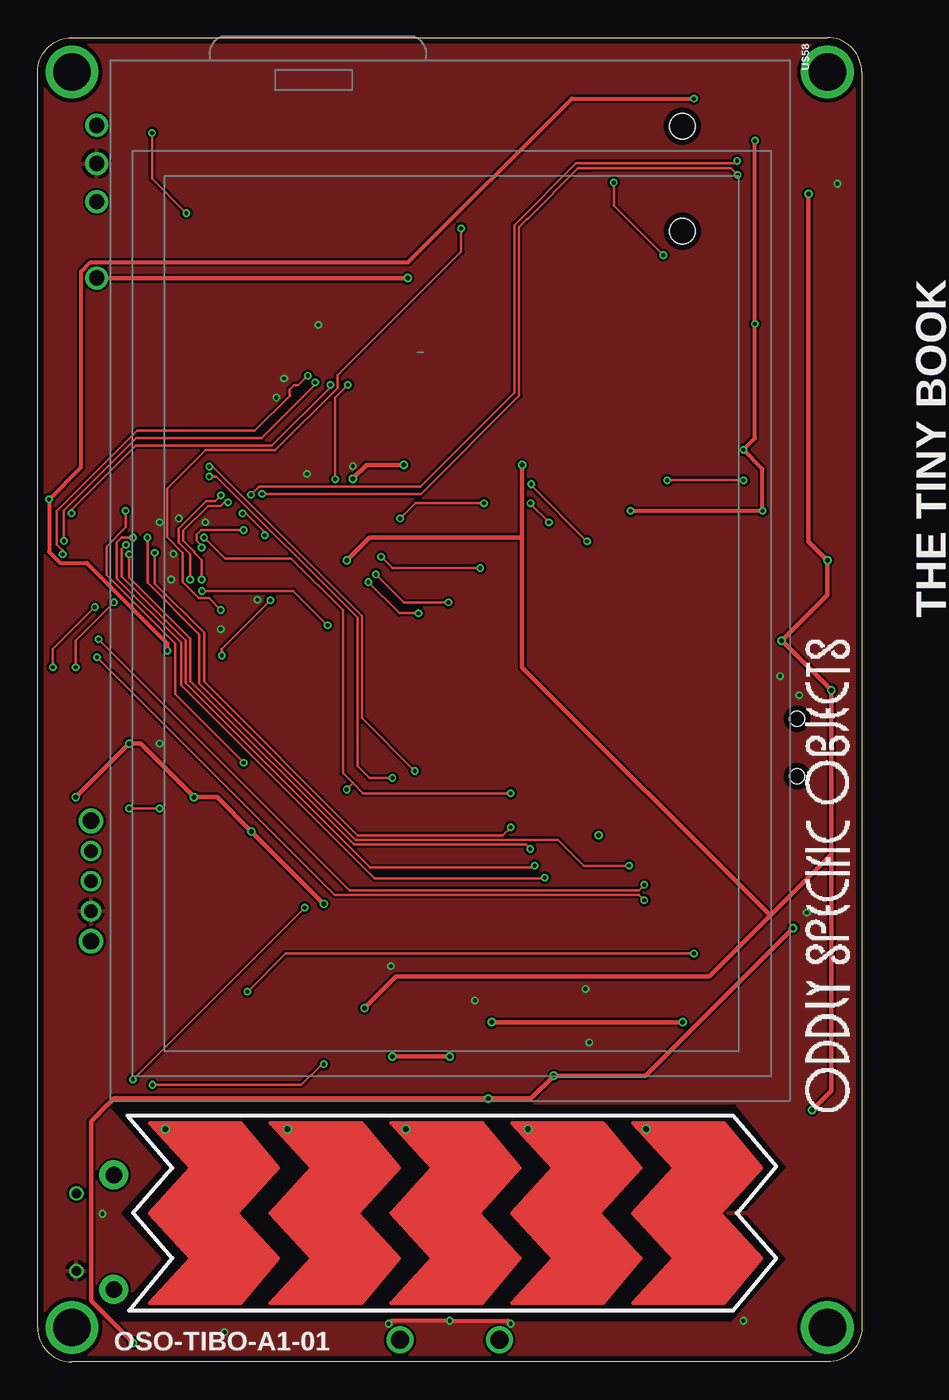
[diagram p2: board, top side]
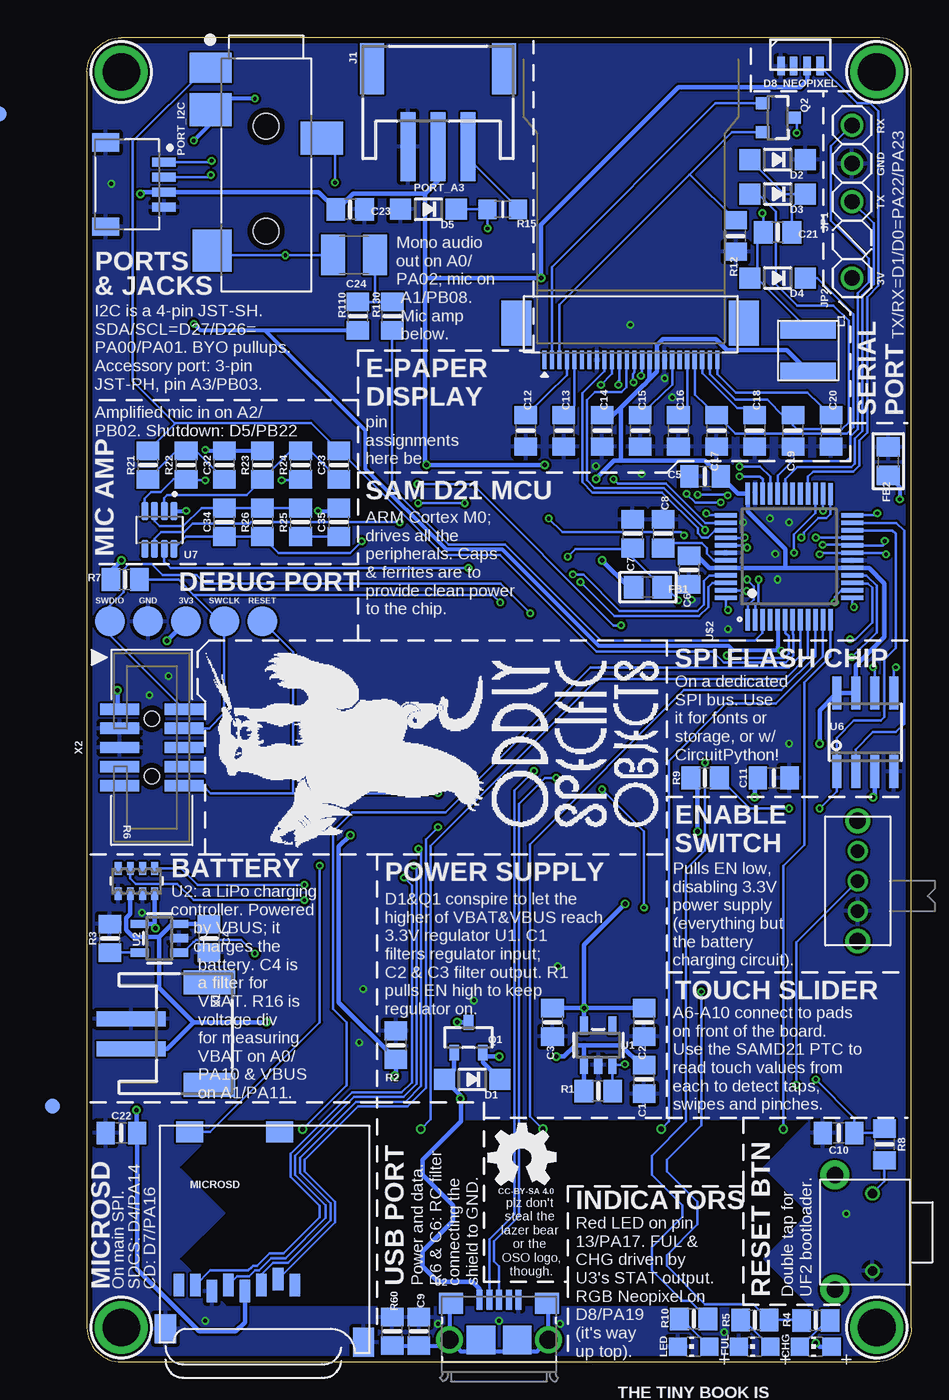
[diagram p3: board, bottom side, seen from below]

Size 54.86 x 88.14 mm. Coordinates in mm from the lower left corner, seen from the top.
Outline: 54.86,85.85 54.86,2.29 arc-90 52.58,0 2.29,0 arc-90 0,2.29 0,85.85 arc-90 2.29,88.14 52.58,88.14 arc-90 54.86,85.85
Copper layers (1*16): Top 0.035559375mm / dielectric 1.6mm / Bottom 0.035559375mm
Design rules "oshpark-2layer *": minimum track width 6mil, minimum drill 10mil, track to track 6mil, track to pad 6mil, pad to pad 6mil, via to via 6mil, smd to smd 6mil, copper to edge 15mil, drill to drill 6mil, minimum pad ring 5mil, minimum via ring 5mil, stop-mask expansion 2.5mil, vias tented up to drill 12mil, thermal gap 10mil
bKeepout: area 20.8,24.1 to 46.2,54.1

### Footprints (pad centres in the part's own frame; a part is rotated, then mirrored left to right if it is on the bottom)
MJTP1117 = drill 0.635: P$1 -2.58,0.04; P$2 2.58,0.04 | drill 1.1 pad 1.93: P$5 -3.81,2.54; P$6 3.81,2.54
0805-NO = smd 1.24 x 1.5: 1 -0.95,0; 2 0.95,0
0805_10MGAP = smd 1.2 x 1.5: 1 -1.05,0; 2 1.05,0
C1210 = smd 1.6 x 2.7: 1 -1.4,0; 2 1.4,0
CHIP-LED0805 = smd 1.2 x 1.2: A 0,-1.05; C 0,1.05
SOD-123 = smd 1.4 x 1.4: A 1.85,0; C -1.85,0
WS2812B_4020 = smd 0.5 x 1.25: 1 1.3,-0.75; 2 0.45,-0.75; 3 -0.45,-0.75; 4 -1.3,-0.75
0805 = smd 1.3 x 1.5: 1 -0.95,0; 2 0.95,0
FIDUCIAL_1MM = smd 1 x 1: 1 0,0
CUI_SJ-43514-SMT = smd 2 x 2.8: 1 -7.15,-3.7 | smd 2.8 x 2.6: 2 5.05,-3.6 | smd 2.2 x 2.8: 3 -2.45,3.7; 4 -4.35,-3.7 | hole 1.7: -3.25,0; 3.75,0
FCI_10118193-0001LF = smd 0.4 x 1.35: 1 -1.3,2.675; 2 -0.65,2.675; 3 0,2.675; 4 0.65,2.675; 5 1.3,2.675 | smd 1.6 x 1.4: S1 -3.2,2.45; S2 3.2,2.45 | smd 1.9 x 1.9: S3 1.2,0; S4 -1.2,0 | drill 1.2: S5 3.302,0; S6 -3.302,0
1X03 = drill 1.016: 1 -2.54,0; 2 0,0; 3 2.54,0
1X01 = drill 1.016: 1 0,0
INDUCTOR_4X4MM_NR401 = smd 1.2 x 3.7: P$1 -1.4,0; P$2 1.4,0
MICROSD = smd 0.7 x 1.5: 1 9,-10.64; 2 7.9,-10.24; 3 6.8,-10.64; 4 5.7,-11.04; 5 4.6,-10.64; 6 3.5,-11.04; 7 2.4,-10.64; 8 1.3,-10.64 | smd 1.8 x 1.4: CD1 2,-0.44; CD2 8,-0.44 | smd 1.4 x 1.9: MT1 0.4,-13.54; MT2 13.6,-14.44
JSTPH3 = smd 1 x 4.6: 1 -2,-2.7; 2 0,-2.7; 3 2,-2.7 | smd 1.6 x 3.4: NC1 -4.4,2.5; NC2 4.4,2.5
JST_SM04B-SRSS-TB(LF)(SN) = smd 0.6 x 1.55: 1 -1.5,0; 2 -0.5,0; 3 0.5,0; 4 1.5,0 | smd 1.2 x 1.8: S1 -2.8,-3.875; S2 2.8,-3.875
SOT23-R = smd 0.635 x 1.016: 1 -0.95,-1; 2 0.95,-1; 3 0,1
SOT23-3 = smd 0.8 x 0.9: 1 -0.95,-1; 2 0.95,-1; 3 0,1.1
EXBV8V = smd 0.838 x 0.457: 1 -0.838,1.219; 2 -0.838,0.406; 3 -0.838,-0.406; 4 -0.838,-1.219; 5 0.838,-1.219; 6 0.838,-0.406; 7 0.838,0.406; 8 0.838,1.219
_0805MP = smd 1.2 x 1.3: 1 -1.016,0; 2 1.016,0
SLIDER_PASSIVE_5SEG_12MM = drill 0.356: SL1 -5.588,-13.462; SL2 -5.588,-5.334; SL3 -5.588,2.54; SL4 -5.588,10.668; SL5 -5.588,18.542
A10767 = drill 1.1: MP1 -4,0; MP2 4,0 | drill 0.9: P$1 -2,0; P$2 0,0; P$3 2,0
TESTPOINT_ROUND_2MM_NO = smd 2 x 2: P$1 0,0
SOT23-5 = smd 0.55 x 1.2: 1 -0.95,-1.3; 2 0,-1.3; 3 0.95,-1.3; 4 0.95,1.3; 5 -0.95,1.3
MICROBUILDER_SOIC8_150MIL = smd 0.6 x 2.2: 1 -1.905,-2.6; 2 -0.635,-2.6; 3 0.635,-2.6; 4 1.905,-2.6; 5 1.905,2.6; 6 0.635,2.6; 7 -0.635,2.6; 8 -1.905,2.6
SOT65P280X145-8N = smd 1.21 x 0.48: 1 -1.255,0.975; 2 -1.255,0.325; 3 -1.255,-0.325; 4 -1.255,-0.975; 5 1.255,-0.975; 6 1.255,-0.325; 7 1.255,0.325; 8 1.255,0.975
MOUNTINGHOLE_2.5_PLATED = drill 2.5 pad 3.2: P$1 0,0
QFP50P900X900X120-48N = smd 1.45 x 0.3: 1 -4.2,2.75; 2 -4.2,2.25; 3 -4.2,1.75; 4 -4.2,1.25; 5 -4.2,0.75; 6 -4.2,0.25; 7 -4.2,-0.25; 8 -4.2,-0.75; 9 -4.2,-1.25; 10 -4.2,-1.75; 11 -4.2,-2.25; 12 -4.2,-2.75; 25 4.17,-2.75; 26 4.2,-2.25; 27 4.2,-1.75; 28 4.2,-1.25; 29 4.2,-0.75; 30 4.2,-0.25; 31 4.2,0.25; 32 4.2,0.75; 33 4.2,1.25; 34 4.2,1.75; 35 4.2,2.25; 36 4.2,2.75 | smd 0.3 x 1.45: 13 -2.75,-4.2; 14 -2.25,-4.2; 15 -1.75,-4.2; 16 -1.25,-4.2; 17 -0.75,-4.2; 18 -0.25,-4.2; 19 0.25,-4.2; 20 0.75,-4.2; 21 1.25,-4.2; 22 1.75,-4.2; 23 2.25,-4.2; 24 2.75,-4.2; 37 2.75,4.2; 38 2.25,4.2; 39 1.75,4.2; 40 1.25,4.2; 41 0.75,4.2; 42 0.25,4.2; 43 -0.25,4.2; 44 -0.75,4.2; 45 -1.25,4.2; 46 -1.75,4.2; 47 -2.25,4.2; 48 -2.75,4.2
EINK_DISPLAY_2_7_IN = smd 1.25 x 0.275 bottom: 1 19.88,-25.679; 2 19.88,-26.179; 3 19.88,-26.679; 4 19.88,-27.179; 5 19.88,-27.679; 6 19.88,-28.179; 7 19.88,-28.679; 8 19.88,-29.179; 9 19.88,-29.679; 10 19.88,-30.179; 11 19.88,-30.679; 12 19.88,-31.179; 13 19.88,-31.679; 14 19.88,-32.179; 15 19.88,-32.679; 16 19.88,-33.179; 17 19.88,-33.679; 18 19.88,-34.179; 19 19.88,-34.679; 20 19.88,-35.179; 21 19.88,-35.679; 22 19.88,-36.179; 23 19.88,-36.679; 24 19.88,-37.179 | smd 3 x 2 bottom: SPRT1 17.42,-23.829; SPRT2 17.42,-38.939
JSTPH2 = smd 1 x 4.6: 1 -1,-3.7; 2 1,-3.7 | smd 1.6 x 3.4: NC1 -3.4,1.5; NC2 3.4,1.5
2X05_1.27MM_BOX_POSTS = smd 0.76 x 2.6: 1 -2.54,-2.15; 2 -2.54,2.15; 3 -1.27,-2.15; 4 -1.27,2.15; 5 0,-2.15; 6 0,2.15; 7 1.27,-2.15; 8 1.27,2.15; 9 2.54,-2.15; 10 2.54,2.15 | hole 1: -1.905,0; 1.905,0

### Placement (x,y rotation side)
BTN_RESET  2.54,8.64 90 bottom
C1  17.78,18.8 270 bottom
C2  17.78,22.61 270 bottom
C3  23.88,22.61 270 bottom
C4  46.74,28.19 270 bottom
C5  13.72,58.93 180 bottom
C6  14.78,52.71 270 bottom
C7  18.54,55.12 270 bottom
C8  16.51,55.12 90 bottom
C9  32.77,2.03 90 bottom
C10  4.83,15.24 0 bottom
C11  9.14,38.86 0 bottom
C12  25.65,61.98 90 bottom
C13  23.11,61.98 90 bottom
C14  20.57,61.98 90 bottom
C15  18.03,61.98 90 bottom
C16  15.49,61.98 90 bottom
C17  12.95,61.98 270 bottom
C18  10.41,61.98 90 bottom
C19  7.87,61.98 270 bottom
C20  5.33,61.98 90 bottom
C21  8.89,75.18 0 bottom
C22  52.58,15.24 180 bottom
C23  37.34,76.71 0 bottom
C24  37.08,73.66 180 bottom
C32  45.72,59.69 90 bottom
C33  38.1,59.69 270 bottom
C34  45.72,55.88 90 bottom
C35  38.1,55.88 90 bottom
CHG  6.35,1.02 90 bottom
D1  29.21,18.8 180 bottom
D2  8.89,80.01 180 bottom
D3  8.89,77.72 180 bottom
D4  8.89,72.14 180 bottom
D5  32.13,76.71 180 bottom
D8_NEOPIXEL  7.37,86.99 0 bottom
FB1  17.53,51.56 0 bottom
FB2  1.52,59.94 270 bottom
FID1  14.73,-6.6 90 bottom  (outside the outline)
FID2  57.15,17.02 270 bottom
FID3  102.62,84.84 90 bottom  (outside the outline)
FID4  -4.57,17.02 270 bottom  (outside the outline)
FID5  2.29,101.09 90 bottom  (outside the outline)
FID6  60.71,83.06 270 bottom  (outside the outline)
FUL  10.41,1.02 90 bottom
GOLD_ORB_SM1  25.91,13.59 0 bottom
J1  42.93,78.99 270 bottom
J2  27.43,1.46 0 bottom
JP1  3.94,79.76 90 bottom
JP2  3.94,72.14 90 bottom
L1  6.86,67.31 270 bottom
LED  14.48,1.02 90 bottom
MICROSD  50.04,15.75 0 bottom
PORT_A3  31.5,83.57 0 bottom
PORT_I2C  49.73,78.36 270 bottom
Q1  29.46,21.59 0 bottom
Q2  8.89,82.8 270 bottom
R1  20.83,18.03 180 bottom
R2  34.29,21.08 90 bottom
R3  53.34,28.19 90 bottom
R4  6.35,2.77 180 bottom
R5  10.41,2.79 0 bottom
R6  51.56,32 270 bottom
R7  52.32,52.07 180 bottom
R8  1.78,14.48 90 bottom
R9  13.72,38.86 180 bottom
R10  14.48,2.87 180 bottom
R12  11.68,74.93 270 bottom
R15  27.18,76.71 180 bottom
R21  50.8,59.69 270 bottom
R22  48.26,59.69 270 bottom
R23  43.18,59.69 270 bottom
R24  40.64,59.69 270 bottom
R25  40.64,55.88 270 bottom
R26  43.18,55.88 270 bottom
R60  34.54,2.03 90 bottom
R110  36.83,69.6 90 bottom
R130  34.54,69.6 90 bottom
SL2  21.97,9.91 270 top
SW1  3.56,32 90 bottom
TP1  50.8,49.28 0 bottom
TP2  48.26,49.28 0 bottom
TP6  45.72,49.28 0 bottom
TP7  53.34,49.28 0 bottom
TP8  43.18,49.28 0 bottom
U1  20.83,21.08 0 bottom
U2  50.04,28.19 90 bottom
U6  3.05,41.91 0 bottom
U7  50.04,55.37 270 bottom
U$1  2.29,85.85 90 bottom
U$2  8.13,53.59 90 bottom
U$4  2.29,2.29 90 bottom
U$5  52.58,85.85 90 bottom
U$7  52.58,2.29 90 bottom
U$45  37.34,40.89 90 bottom
U$47  21.92,41.15 90 bottom
U$48  52.58,16.61 90 top
U$58  50.09,86.56 270 top
X1  48.21,21.84 270 bottom
X2  50.55,40.89 270 bottom

### Tracks (layer width: path | path; a pad name or v marks a point on that pad's centre or on a via)
!RESET  (via drill 0.25)
  Top 0.152: v31.5,37.85 21.67,37.85 20.99,38.52 | 20.99,38.52 20.32,39.19 20.32,50.04 16.89,53.47 12.47,53.47 v11.08,54.86 | 20.99,38.52 v20.57,38.1 | v17.78,30.23 v6.35,18.8
  Bottom 0.152: TP8.P$1 41.15,47.24 41.15,37.85 | U$2.40 11.1,54.84 v11.08,54.86 | v20.57,38.1 17.78,35.31 v17.78,30.23 | v6.35,18.8 3.78,16.22 C10.2 2.07,15.24 R8.2 | X2.10 47.13,38.35 46.62,37.85 41.15,37.85 | v31.5,37.85 41.15,37.85
+3V3  (via drill 0.3)
  Top 0.305: v21.77,23.55 23.88,25.65 44.7,25.65 48.77,29.72 | 48.77,29.72 52.83,33.78 | 52.83,33.78 v52.83,44.7 v49.53,48.01 52.58,51.05 v52.58,53.34 51.31,54.61 v51.31,77.72 | v32.26,59.69 32.26,54.86 | 32.26,54.86 32.26,46.23 48.77,29.72 | v20.98,58.78 21.89,59.69 v24.38,59.69 | 32.26,54.86 22.1,54.86 v20.57,53.34 | v19.05,30.48 v14.22,35.31 11.94,37.59 v10.41,37.59 6.86,41.15 v6.1,41.15 v2.54,37.59 | JP2.1 v24.64,72.14 | 52.83,33.78 52.83,18.03 v51.56,16.76
  Bottom 0.305: C14.2 19.91,62.93 19.32,63.52 | 17.41,65.39 17.78,65.02 17.82,65.02 19.32,63.52 | 17.41,65.39 16.91,65.89 U$58.16 16.91,67.67 16.51,68.07 13.01,68.07 12.28,67.34 8.29,67.34 L1.P$2 | U$58.15 17.41,65.39 | C6.1 14.25,53.66 13.44,52.84 U$2.44 8.38,52.84 | C3.1 21.84,23.56 | 21.84,23.56 C2.1 | U1.5 21.78,23.49 | 21.84,23.56 21.78,23.49 | 8.38,52.84 U$2.17 3.92,52.83 2.79,52.83 1.78,51.82 1.78,48.26 3.68,46.36 U6.7 U6.8 6.1,43.37 v6.1,41.15 | 19.32,63.52 19.32,59.98 | 19.32,59.98 13.72,59.98 C5.1 11.53,57.79 U$2.36 10.88,56.6 8.38,54.1 8.38,52.84 | 21.78,23.49 v21.78,23.54 v21.77,23.55 21.77,27.76 v19.05,30.48 | v52.83,44.7 52.83,43.57 X2.1 | v49.53,48.01 TP2.P$1 | v52.58,53.34 53.27,52.64 R7.2 | v51.31,77.72 51.17,77.86 PORT_I2C.3 39.44,77.86 C23.1 38.19,76.71 37.13,77.76 32.35,77.76 | PORT_A3.2 31.5,78.62 32.35,77.76 | 32.35,77.76 32.35,72.14 | 32.35,72.14 32.35,59.78 v32.26,59.69 v24.38,59.69 | 19.32,59.98 19.77,59.98 v20.98,58.78 | v20.57,53.34 18.8,51.56 FB1.1 | v2.54,37.59 2.41,37.72 U6.3 | v10.41,37.59 10.41,38.64 C11.1 | 32.35,72.14 v24.64,72.14 24.64,75.69 15.49,84.84 7.37,84.84 6.92,85.29 D8_NEOPIXEL.2 | R9.2 14.22,38.42 v14.22,35.31 | MICROSD.4 44.34,2.65 44.96,2.03 47.38,2.03 51.53,6.18 C22.1 51.56,15.27 v51.56,16.76
_ACCESSORY
  Bottom 0.152: PORT_A3.3 29.5,80.1 26.42,77.02 26.42,76.96 R15.1
A0_AUDIO
  Bottom 0.152: U$2.3 9.91,49.37 9.91,48.51 10.41,48.01 20.65,48.01 27.05,54.41 30.79,54.41 34.54,58.17 R130.1
A1_MICRAW
  Bottom 0.152: U$2.7 7.88,48.45 7.85,48.43 7.85,47.01 8.33,46.53 12.47,46.53 13.23,47.3 20.95,47.3 27.36,53.7 31.11,53.7 38.05,60.64 C33.1 39.94,62.48 48.96,62.48 | R21.1 48.96,62.48 | 48.96,62.48 49.02,62.48 51.82,65.28 51.82,81.23 46.9,86.14 J1.1
A2_MICAMP  (via drill 0.25)
  Top 0.152: v10.95,51.31 17.02,51.31 v19.3,49.02 | v36.58,54.61 32.87,58.32 v32.87,58.42
  Bottom 0.152: U$2.47 10.98,51.34 v10.95,51.31 | U7.8 48.25,54.93 C34.1 R26.2 42.1,53.85 37.34,53.85 v36.58,54.61 | v32.87,58.42 29.21,58.42 19.81,49.02 v19.3,49.02
A3_ACCESSORY  (via drill 0.25)
  Top 0.152: v28.19,75.44 28.19,73.89 19.97,65.67 19.97,64.82 15.83,60.68 11.18,60.68 8.61,58.11 8.61,54.89 9.65,53.85 9.65,51.9 10.72,50.83 11.4,50.83 v12.19,50.04
  Bottom 0.152: v28.19,75.44 R15.2 D5.C | U$2.48 12.33,50.17 v12.19,50.04
A4_VBATMON  (via drill 0.25)
  Top 0.152: v40.39,31.75 40.03,31.39 20.76,31.39 v4.06,48.09
  Bottom 0.152: v4.06,48.09 3.72,48.09 2.6,49.21 2.6,51.54 2.88,51.82 3.9,51.82 U$2.15 | v40.39,31.75 47.5,31.75 48.59,32.84 R6.1 R6.2
A5_VBUSMON  (via drill 0.25)
  Top 0.152: v40.39,30.73 40.03,31.09 19.76,31.09 v3.95,46.9
  Bottom 0.152: v3.95,46.9 2.3,48.55 2.3,51.67 2.98,52.35 U$2.16 | R6.4 R6.3 51.97,32.18 51.62,31.83 48.84,31.83 47.75,30.73 v40.39,30.73
A6_HSLIDER_1
  Bottom 0.152: U$2.12 5.38,46.95 7.11,45.21 7.11,34.42 8.51,33.02 SL2.SL1
A7_HSLIDER_2
  Bottom 0.152: U$2.11 5.88,46.95 9.02,43.82 12.32,43.82 16.13,40.01 16.13,16 SL2.SL2
A8_HSLIDER_3
  Bottom 0.152: U$2.10 6.38,46.96 8.64,44.7 15.11,44.7 25.38,34.44 25.38,16.36 SL2.SL3
A9_HSLIDER_4
  Bottom 0.152: U$2.9 6.88,46.97 8.38,45.47 20.88,45.47 32,34.34 32,16.13 SL2.SL4
A10_HSLIDER_5
  Bottom 0.152: U$2.8 7.38,47 8.15,46.23 21.34,46.23 30.99,36.58 37.21,36.58 38.48,35.31 38.48,23.49 37.59,22.61 37.59,18.41 SL2.SL5
AGND  (via drill 0.25)
  Top 0.254: v39.48,56.64 v48.26,56.64 48.26,59.44 v46.99,60.71 47.75,61.47 v47.75,69.09 v47.75,81.28 | v43.69,84.07 35.56,84.07 24.66,73.18 3.51,73.18 2.9,72.57 2.9,59.54 v0.76,57.4 0.76,53.91 1.5,53.18 3.29,53.18 8.64,47.83 v8.64,47.34
  Bottom 0.254: U7.1 48.27,56.63 v48.26,56.64 | v46.99,60.71 46.92,60.64 C32.2 R23.1 | v39.48,56.64 38.29,56.64 C35.2 | v47.75,81.28 46.63,82.41 46.63,83.06 | 46.63,83.06 J1.4 | v43.69,84.07 45.61,84.07 46.63,83.06 | R110.1 42.99,68.65 | 42.99,68.65 47.31,68.65 v47.75,69.09 | 42.99,68.65 36.32,61.98 36.32,59.44 30.94,54.05 27.2,54.05 20.8,47.65 12.15,47.65 11.84,47.34 v8.64,47.34 8.88,47.57 U$2.5 | FB2.2 0.76,58.23 v0.76,57.4
AUDIO_OUT  (via drill 0.25)
  Top 0.152: v38.35,78.49 38.35,76.96 v41.66,73.66
  Bottom 0.152: J1.2 46.24,73.66 v41.66,73.66 C24.2 | J1.3 38.35,80.57 v38.35,78.49
AVCC  (via drill 0.25)
  Top 0.152: v15.5,50.69 12.27,47.46 v12.27,47.02 | v29.46,52.83 23.62,52.83 v22.86,53.59
  Bottom 0.152: v12.27,47.02 12.09,46.84 8.46,46.84 8.16,47.14 8.16,48.3 8.38,48.52 U$2.6 | v15.5,50.69 16.37,51.56 FB1.2 18.54,53.53 18.54,54.1 | C7.2 18.54,54.1 | U7.7 49.71,53.27 49.28,52.83 v29.46,52.83 | v22.86,53.59 22.35,54.1 18.54,54.1
D0_SERCOM3_RX
  Bottom 0.152: U$2.32 8.88,58.97 7.91,59.94 4.32,59.94 4.06,60.19 4.06,61.57 3.54,62.09 3.54,71.13 2.81,71.86 2.81,73.42 5.33,75.95 5.33,80.9 JP1.3
D1_SERCOM3_TX
  Bottom 0.152: U$2.31 8.38,58.77 7.58,59.56 3.98,59.56 3.75,59.79 3.75,61.44 3.24,61.96 3.24,71 2.5,71.74 2.5,75.78 JP1.1
D4_SDCS  (via drill 0.25)
  Top 0.152: v7.8,53.85 7.8,51.81 11.07,48.53 11.07,45.29 21.31,35.05 30.96,35.05 v31.5,35.59
  Bottom 0.152: MICROSD.2 38.35,9.29 38.35,10.67 40.39,12.7 40.39,13.46 36.83,17.02 33.53,17.02 32.31,18.24 32.31,34.77 v31.5,35.59 | v7.8,53.85 7.8,55.06 6.38,56.48 U$2.27
D5_MICSHDN  (via drill 0.25)
  Top 0.152: v13.64,56.47 13.89,56.47 15.12,55.24 v15.12,55.01 | v34.04,55.88 32.82,57.1 v32.82,57.15 | v29.72,57.15 25.15,57.15 v24.13,56.13
  Bottom 0.152: U$2.37 13.52,56.34 v13.64,56.47 | v15.12,55.01 15.32,55.22 23.21,55.22 v24.13,56.13 | U7.6 50.36,54.79 49.92,55.23 48.38,55.23 47.83,55.78 44.04,55.78 43.94,55.88 v34.04,55.88 | v32.82,57.15 v29.72,57.15
D6_FLASH_CS  (via drill 0.25)
  Top 0.152: v8.13,36.83 v6.1,36.83
  Bottom 0.152: U$2.22 1.24,55.34 1.02,55.12 1.02,47.5 1.78,46.74 1.78,42.93 2.03,42.67 3.81,42.67 4.95,41.53 4.95,39.37 U6.1 4.95,37.97 v6.1,36.83 | R9.1 10.73,36.83 v8.13,36.83
D7_SDCD  (via drill 0.25)
  Top 0.152: v7.32,54.86 7.32,51.86 10.77,48.4 10.77,45.16 21.18,34.75 34.64,34.75 36.37,33.02 v39.37,33.02
  Bottom 0.152: U$2.25 5.38,56.44 5.66,56.16 6.17,56.16 7.14,55.19 7.14,55.04 v7.32,54.86 | MICROSD.CD1 46.67,15.31 39.37,22.61 v39.37,33.02
D8_NEOPIXEL
  Bottom 0.152: U$2.28 6.88,58.91 6.53,59.26 3.86,59.26 3.45,59.66 3.45,61.32 2.93,61.83 2.93,70.88 2.2,71.61 2.2,83.22 2.73,83.76 3.58,83.76 3.98,84.16 4.11,84.29 D8_NEOPIXEL.1
D9_EINK_CS  (via drill 0.25)
  Top 0.152: v10.92,54.2 10.92,54.34 10.6,54.66 10.6,55.06 10.89,55.36 v13.72,55.36
  Bottom 0.152: U$58.12 18.96,66.63 18.96,64.87 19.29,64.54 21.05,64.54 21.59,64 21.59,58.67 21.08,58.17 16.45,58.17 13.72,55.43 v13.72,55.36 | v10.92,54.2 11.06,54.34 U$2.41
D10_EINK_DC  (via drill 0.25)
  Top 0.152: v2.25,56.47 2.25,56.7 6.54,60.98 15.59,60.98 19.49,64.88 v19.49,65.02
  Bottom 0.152: U$58.11 19.41,65.34 19.49,65.26 v19.49,65.02 | v2.25,56.47 2.38,56.34 U$2.24
D11_EINK_BUSY
  Bottom 0.152: U$58.9 20.41,65.95 21.89,64.46 21.89,58.55 21.21,57.86 16.58,57.86 14.2,55.48 14.2,55.16 13.92,54.88 13.52,54.88 13.05,55.34 U$2.39
D12_EINK_RST  (via drill 0.25)
  Top 0.152: v20.65,65.02 19.81,64.19 v19.81,58.75
  Bottom 0.152: U$58.10 19.91,65.76 v20.65,65.02 | v19.81,58.75 19.53,58.47 16.33,58.47 13.7,55.84 U$2.38
D13_LED  (via drill 0.25)
  Top 0.152: v5.86,56.64 5.86,55.55 4.59,54.28 4.59,52.38 9.14,47.83 9.14,44.45 v13.72,39.88
  Bottom 0.152: R10.1 14.72,4.06 15.24,4.06 17.27,6.1 17.27,7.62 15.24,9.65 15.24,10.41 17.27,12.45 17.27,13.72 14.99,16 14.99,32.77 13.72,34.04 v13.72,39.88 | U$2.26 5.88,56.66 v5.86,56.64
D14_SERCOM4_MOSI  (via drill 0.25)
  Top 0.152: v17.99,65.63 17.36,65 17.07,65 16.79,64.72 16.79,64.32 16.8,64.31 14.46,61.98 6.62,61.98 1.27,56.62 1.27,54.41 1.68,54.01 v1.68,53.75 | v6.09,53.75 v6.1,53.75 6.1,52.19 10.16,48.13 10.16,45.32 21.05,34.42 32.51,34.42 v32.79,34.14
  Bottom 0.152: U$58.14 17.91,65.71 v17.99,65.63 | v1.68,53.75 1.77,53.84 U$2.19 6,53.84 v6.09,53.75 | MICROSD.3 43.24,5.83 42.47,6.6 41.47,6.6 38.66,9.42 38.66,10.54 40.69,12.57 40.69,13.59 36.96,17.32 33.65,17.32 32.61,18.36 32.61,33.97 v32.79,34.14
D15_SERCOM4_SCK  (via drill 0.25)
  Top 0.152: v1.75,54.64 1.75,56.65 6.58,61.48 14.92,61.48 18.48,65.03 v18.48,65.19 | v5.89,54.38 5.59,54.08 5.59,52.27 9.86,48 9.86,45.19 22.12,32.92 32.99,32.92 v33.1,33.02
  Bottom 0.152: U$58.13 18.41,65.87 18.52,65.75 18.52,65.23 v18.48,65.19 | v1.75,54.64 1.75,54.49 1.9,54.34 U$2.20 3.96,54.38 v5.89,54.38 | MICROSD.5 44.86,5.69 44.08,5.69 43.68,6.09 43.41,6.09 42.59,6.91 41.66,6.91 38.96,9.6 38.96,10.42 41,12.45 41,13.71 37.08,17.63 33.78,17.63 32.92,18.49 32.92,32.84 v33.1,33.02
D16_SERCOM4_MISO  (via drill 0.25)
  Top 0.152: v6.35,54.86 5.61,54.86 5.28,54.54 5.28,52.14 9.55,47.87 9.55,45.06 22.43,32.18 33.71,32.18 v33.76,32.23
  Bottom 0.152: U$2.21 3.95,54.86 v6.35,54.86 | MICROSD.7 46.66,6.09 44.13,6.09 43.9,6.31 43.89,6.31 43.81,6.39 43.54,6.39 42.72,7.21 41.78,7.21 39.37,9.63 39.37,10.39 41.3,12.32 41.3,13.84 37.21,17.93 33.91,17.93 33.22,18.62 33.22,31.7 v33.76,32.23
D17_FLASH_SERCOM2_MOSI  (via drill 0.25)
  Top 0.152: v3.81,50.24 1.02,47.45 v1.02,46.23
  Bottom 0.152: U$2.13 3.93,50.36 v3.81,50.24 | v1.02,46.23 1.14,46.1 U6.5
D18_FLASH_SERCOM2_SCK  (via drill 0.25)
  Top 0.152: v5.08,50.55 2.54,48.01 v2.54,46.23
  Bottom 0.152: U$2.14 4.64,51.34 5.08,50.9 v5.08,50.55 | v2.54,46.23 2.41,46.1 U6.6
D19_FLASH_SERCOM2_MISO
  Bottom 0.152: U$2.23 0.98,55.84 0.46,55.32 0.46,42.47 1.02,41.91 2.54,41.91 3.68,40.77 U6.2
D20_SERCOM1_SDA  (via drill 0.25)
  Top 0.152: v14.95,57.77 25.51,57.77 32.05,64.3 32.05,75.52 32.57,76.04 32.57,76.05 32.63,76.1 35.98,79.45 36.75,79.45 36.77,79.46 36.84,79.45 46.15,79.45 v46.61,78.99 | v10.92,52.07 10.92,53.37 10.46,53.83 10.46,53.9 9.7,54.66 9.7,55.32 11.35,56.97 12.19,56.97 12.42,57.2 v12.68,57.2
  Bottom 0.152: v12.68,57.2 14.38,57.2 v14.95,57.77 | v46.61,78.99 v46.62,79 46.76,78.86 PORT_I2C.2 | U$2.1 10.88,50.34 10.46,50.75 10.46,51.61 v10.92,52.07
D21_SERCOM1_SCL  (via drill 0.25)
  Top 0.152: v14.21,57.72 14.75,58.25 25.49,58.25 31.74,64.51 31.74,75.67 35.85,79.77 46.4,79.77 v46.56,79.93 | v10.16,52.07 10.16,53.77 9.4,54.53 9.4,55.45 11.22,57.28 11.81,57.28 v12.21,57.67
  Bottom 0.152: v12.21,57.67 12.26,57.72 v14.21,57.72 | PORT_I2C.1 46.63,79.86 v46.56,79.93 | v10.16,52.07 10.16,50.55 10.38,50.33 U$2.2
EN  (via drill 0.25)
  Top 0.152: v19.05,19.81 18.92,19.81 17.55,18.44 v7.64,18.44
  Bottom 0.152: R1.1 U1.3 19.08,19.78 v19.05,19.81 | v7.64,18.44 7.64,27.91 SW1.P$2
GDR
  Bottom 0.152: U$58.2 23.91,72.86 13.02,83.75 Q2.1
GND  (via drill 0.25)
  Top 0.254: v31.5,2.54 31.29,2.74 v27.43,2.74 23.57,2.74 v23.37,2.54
  other vias: 8.13,55.88 9.04,53.77 8.89,52.07 12.19,48.77 14.63,50.72 17.93,59.11 9.4,56.13 15.9,64.19 20.98,59.61 18.69,69.01 16.41,65.46 49.43,45.64 50.7,44.37 23.52,26.34 29.11,24.05 36.47,24.82 12.45,1.98 46.99,2.74 8.13,41.15 51.21,29.9 53.24,78.41 36.73,21.26 4.32,9.86 11.18,55.88
  pour Bottom (rank 6): 57.15,-1.27 57.15,88.39 56.64,88.9 1.52,88.9 -1.52,85.85 -1.52,1.02 0.76,-1.27
  pour Top: 58.17,-0.76 58.17,90.68 -2.78,90.68 -2.78,3.54 1.52,-0.76
  cutout Bottom (rank 6): 45.54,16 6.93,16 9.98,12.95 6.93,9.91 9.98,6.86 6.93,3.81 45.54,3.81 48.59,6.86 45.54,9.91 48.59,12.95
  pour Top: 58.17,-0.76 58.17,90.68 -2.78,90.68 -2.78,3.54 1.52,-0.76
MIC_BIAS_PWR  (via drill 0.25)
  Top 0.152: v46.99,58.67 v41.91,58.67
  Bottom 0.152: U7.4 51.01,57.45 50.57,57.89 49.95,57.89 49.1,58.74 R22.2 48.19,58.67 v46.99,58.67 | v41.91,58.67 40.71,58.67 R24.2
N$1
  Bottom 0.152: BTN_RESET.P$2 1.78,12.02 R8.1
N$2
  Bottom 0.152: D2.A 8.45,77.72 D3.C 7.94,76.82 C21.2
N$3  (via drill 0.25)
  Top 0.152: v9.91,76.45 7.62,78.74 v7.62,81.79
  Bottom 0.152: L1.P$1 10.28,72.14 D4.A 10.23,72.64 10.23,74.79 C21.1 9.84,76.39 v9.91,76.45 | Q2.3 7.62,82.63 v7.62,81.79
N$4
  Bottom 0.152: R4.1 5.6,2.77 7.35,1.02 CHG.C
N$6
  Bottom 0.152: 35.68,70.55 R110.2 | C24.1 35.68,70.55 | R130.2 35.68,70.55
N$7
  Bottom 0.152: R10.2 15.28,2.87 LED.A
N$9
  Bottom 0.152: R5.1 11.17,2.79 9.39,1.02 FUL.A
N$65
  Bottom 0.152: R21.2 48.9,60.64 R22.1 47.62,60.64 C32.1
N$67
  Bottom 0.152: U7.2 49.71,57.48 49.51,57.68 44.24,57.68 R23.2 41.28,60.64 R24.1 40,60.64 C33.2
N$68
  Bottom 0.152: R25.1 R26.1 C34.2 47.24,56.83 48.45,55.63 50.04,55.63 50.36,55.95 U7.3
N$69
  Bottom 0.152: C35.1 R25.2
PREVGH
  Bottom 0.152: U$58.21 14.41,64.38 C17.1 12.87,62.93 11.72,61.77 4.29,61.77 3.85,62.21 3.85,69.74 6.24,72.14 D4.C
PREVGL
  Bottom 0.152: C19.1 | C19.1 8.49,62.95 9.57,64.03 11.71,64.03 13.41,65.73 U$58.23 | D3.A 10.18,77.72 8.99,76.54 8.99,71.73 7.56,70.3 5.17,70.3 4.16,69.3 4.16,62.53 4.61,62.08 7.62,62.08 7.88,62.34 C19.1
PROG
  Bottom 0.152: R3.1 U2.5
RESE
  Bottom 0.152: Q2.2 11.92,81.85 14.76,79.02 | 14.76,79.02 23.41,70.37 U$58.3 | R12.1 14.72,79.02 14.76,79.02
SHIELD
  Bottom 0.254: R60.1 C9.1 31.11,1.08 J2.S6 | J2.S6 29.97,0.7 29.39,0.7 J2.S4 27.87,0.7 26.99,0.7 J2.S3 25.47,0.7 24.89,0.7 J2.S5 24.13,3.81 J2.S2 | J2.S1 30.73,3.81 J2.S6
STAT  (via drill 0.25)
  Top 0.152: v13.97,24.64 16.51,27.18 v43.69,27.18
  Bottom 0.152: R4.2 7.33,2.79 R5.2 10.52,3.85 13.72,3.85 16.26,6.39 16.26,7.11 14.22,9.14 14.22,10.67 16.26,12.7 16.26,13.46 13.97,15.75 v13.97,24.64 | v43.69,27.18 44.6,28.09 47.58,28.09 47.73,27.94 47.75,27.94 48.45,27.24 U2.1
SWCLK  (via drill 0.25)
  Top 0.152: v22.52,52.41 24.39,50.55 v27.35,50.55
  Bottom 0.152: TP6.P$1 45.72,49.02 | 45.72,49.02 45.72,43.18 46.74,42.16 X2.4 | R7.1 48.77,52.07 47.75,51.05 | 47.75,51.05 45.72,49.02 | v22.52,52.41 22.49,52.39 21.81,52.39 19.41,49.98 14.22,49.98 13.8,50.4 13.8,51.98 13.44,52.34 U$2.45 | v27.35,50.55 27.86,51.05 47.75,51.05
SWDIO  (via drill 0.25)
  Top 0.152: v25.36,49.82 24.09,49.82 v22.01,51.9
  Bottom 0.152: X2.2 53.34,48.38 TP7.P$1 53.34,50.31 52.42,51.23 52.42,52.73 52.07,53.09 50.55,53.09 49.84,52.38 47.55,52.38 46.96,51.79 27.33,51.79 v25.36,49.82 | v22.01,51.9 19.74,49.63 14.12,49.63 13.5,50.25 13.5,51.56 13.22,51.84 U$2.46
USB_N  (via drill 0.25)
  Top 0.152: v25.11,39.33 21.59,42.84 21.59,49.66 11.66,59.59 v11.43,59.59
  Bottom 0.152: J2.2 28.08,8.16 26.42,9.83 26.42,38.02 v25.11,39.33 | U$2.33 9.38,58.91 10.06,59.59 v11.43,59.59
USB_P  (via drill 0.25)
  Top 0.152: v23.62,38.86 22.1,38.86 21.29,39.68 21.29,49.53 11.89,58.93 v11.43,58.93
  Bottom 0.152: J2.3 27.43,6.35 27.78,6.7 27.78,8.04 26.11,9.7 26.11,37.14 24.38,38.86 v23.62,38.86 | v11.43,58.93 10.06,58.93 9.88,58.75 U$2.34
V+  (via drill 0.3)
  Top 0.305: v27.43,20.32 v23.62,20.32
  Bottom 0.305: 21.78,21.08 U1.1 R1.2 | 21.78,21.08 19.3,21.08 17.97,19.75 C1.1 | D1.C 28.51,19.95 Q1.2 28.24,20.32 v27.43,20.32 | v23.62,20.32 23.11,20.32 22.35,21.08 21.78,21.08
VBAT  (via drill 0.3)
  Top 0.305: v42.93,22.61 v30.23,22.61
  Bottom 0.305: X1.2 49.51,20.84 47.75,22.61 | 47.75,22.61 v42.93,22.61 | v30.23,22.61 30.21,22.59 Q1.3 | 50.05,28.3 51.8,28.3 52.24,28.74 52.24,29.54 51.97,29.82 R6.6 | 50.05,28.3 49.2,29.14 U2.3 C4.1 | 50.05,28.3 50.05,24.9 47.75,22.61
VBUS  (via drill 0.3)
  Top 0.305: v50.29,28.88 40.46,19.05 v34.36,19.05 32.84,17.53 v30,17.53 5.07,17.53 4.76,17.22 4.68,17.15 4.68,17.14 3.56,16.02 3.56,4.08 6.36,1.28 v6.35,1.27
  Bottom 0.305: v34.36,19.05 34.29,19.12 R2.1 38.1,23.94 38.1,34.29 v37.34,35.05 | Q1.1 30.41,19.44 D1.A 30,17.74 v30,17.53 30.04,17.53 29.97,17.45 29.97,16 32.51,13.46 32.51,12.45 30.48,10.41 30.48,9.4 32.51,7.37 32.51,6.35 31.5,5.33 29.21,5.33 28.73,4.86 J2.1 | U2.4 50.56,29.14 v50.29,28.88 50.34,28.93 R6.8 | v6.35,1.27 6.1,1.02 CHG.A
VCOM
  Bottom 0.152: C20.2 6.92,64.52 11.68,64.52 12.91,65.74 U$58.24
VDD
  Bottom 0.152: C15.2 15.91,65.05 U$58.18
VDDCORE
  Bottom 0.152: U$2.43 13.13,53.34 13.6,53.82 13.6,54.17 13.94,54.51 15.82,54.51 16.16,54.17 C8.1
VGH
  Bottom 0.152: C13.2 22.41,63.63 U$58.5
VGL
  Bottom 0.152: C12.2 22.91,65.67 U$58.4
VSH
  Bottom 0.152: C16.2 14.91,63.51 U$58.20
VSL
  Bottom 0.152: C18.2 10.96,63.47 11.58,63.47 13.91,65.8 U$58.22

### Text on the board
tPlace: ``Less is only more where more is no good.'' / / - Frank Lloyd Wright | THE TINY BOOK | THE | tiny | BOOK | OSO-TIBO-A1-01
bPlace: The Open Book by Joey Castillo / @josecastillo. Based in large / part on @Adafruit's awesome / open source designs! OSO logo / & lazer bear by Joseph Devens, / @DoctorDevens. Thanks to Tom F, / Josh L, Brent R, OSHPark & many / others. Made with . in BK & TX. | RX | GND | TX | Mono audio / out on A0/ / PA02; mic on / A1/PB08. / Mic amp / below. | PORTS / & JACKS | 3V | I2C is a 4-pin JST-SH. / SDA/SCL=D27/D26= / PA00/PA01. BYO pullups. / Accessory port: 3-pin / JST-PH, pin A3/PB03. | TX/RX=D1/D0=PA22/PA23 | E-PAPER / DISPLAY | Amplified mic in on A2/ / PB02. Shutdown: D5/PB22 | SERIAL / PORT | pin / assignments / here be | SAM D21 MCU | ARM Cortex M0; / drives all the / peripherals. Caps / & ferrites are to / provide clean power / to the chip. | MIC AMP | DEBUG PORT | RESET | SWCLK | 3V3 | GND | SWDIO | SPI FLASH CHIP | On a dedicated / SPI bus. Use / it for fonts or / storage, or w/ / CircuitPython! | ENABLE / SWITCH | Connector and test / points give access / to SWD interface. / R7=SWCLK pullup. | Pulls EN low, / disabling 3.3V / power supply / (everything but / the battery / charging circuit). | POWER SUPPLY | BATTERY | U2: a LiPo charging / controller. Powered / by VBUS; it / charges the / battery. C4 is / a filter for / VBAT. R16 is / voltage div / for measuring / VBAT on A0/ / PA10 & VBUS / on A1/PA11. | D1&Q1 conspire to let the / higher of VBAT&VBUS reach / 3.3V regulator U1. C1 / filters regulator input; / C2 & C3 filter output. R1 / pulls EN high to keep / regulator on. | TOUCH SLIDER | A6-A10 connect to pads / on front of the board. / Use the SAMD21 PTC to / read touch values from / each to detect taps, / swipes and pinches. | INDICATORS | CC-BY-SA 4.0 | Red LED on pin / 13/PA17. FUL & / CHG driven by / U3's STAT output. / RGB Neopixel on / D8/PA19 / (it's way / up top). | plz don't / steal the / lazer bear / or the / OSO logo, / though. | Double tap for / UF2 bootloader. | RESET BTN | Power and data. / R6 & C6: RC filter / connecting the / shield to GND. | USB PORT | On main SPI. / SDCS: D4/PA14 / CD: D7/PA16 | MICROSD | CC-BY Acknowledgments: / So many footprints and / ideas from @Adafruit. / Capacitive touch slider / based on a design / from @PatternAgents. / Me? I'm Joey / / @josecastillo | THE TINY BOOK IS / OPEN SOURCE / HARDWARE!